# EAGLE schematic Hutschienenmoped_XL_12V (EAGLE 9.6.2)

## Sheet 1 of 12
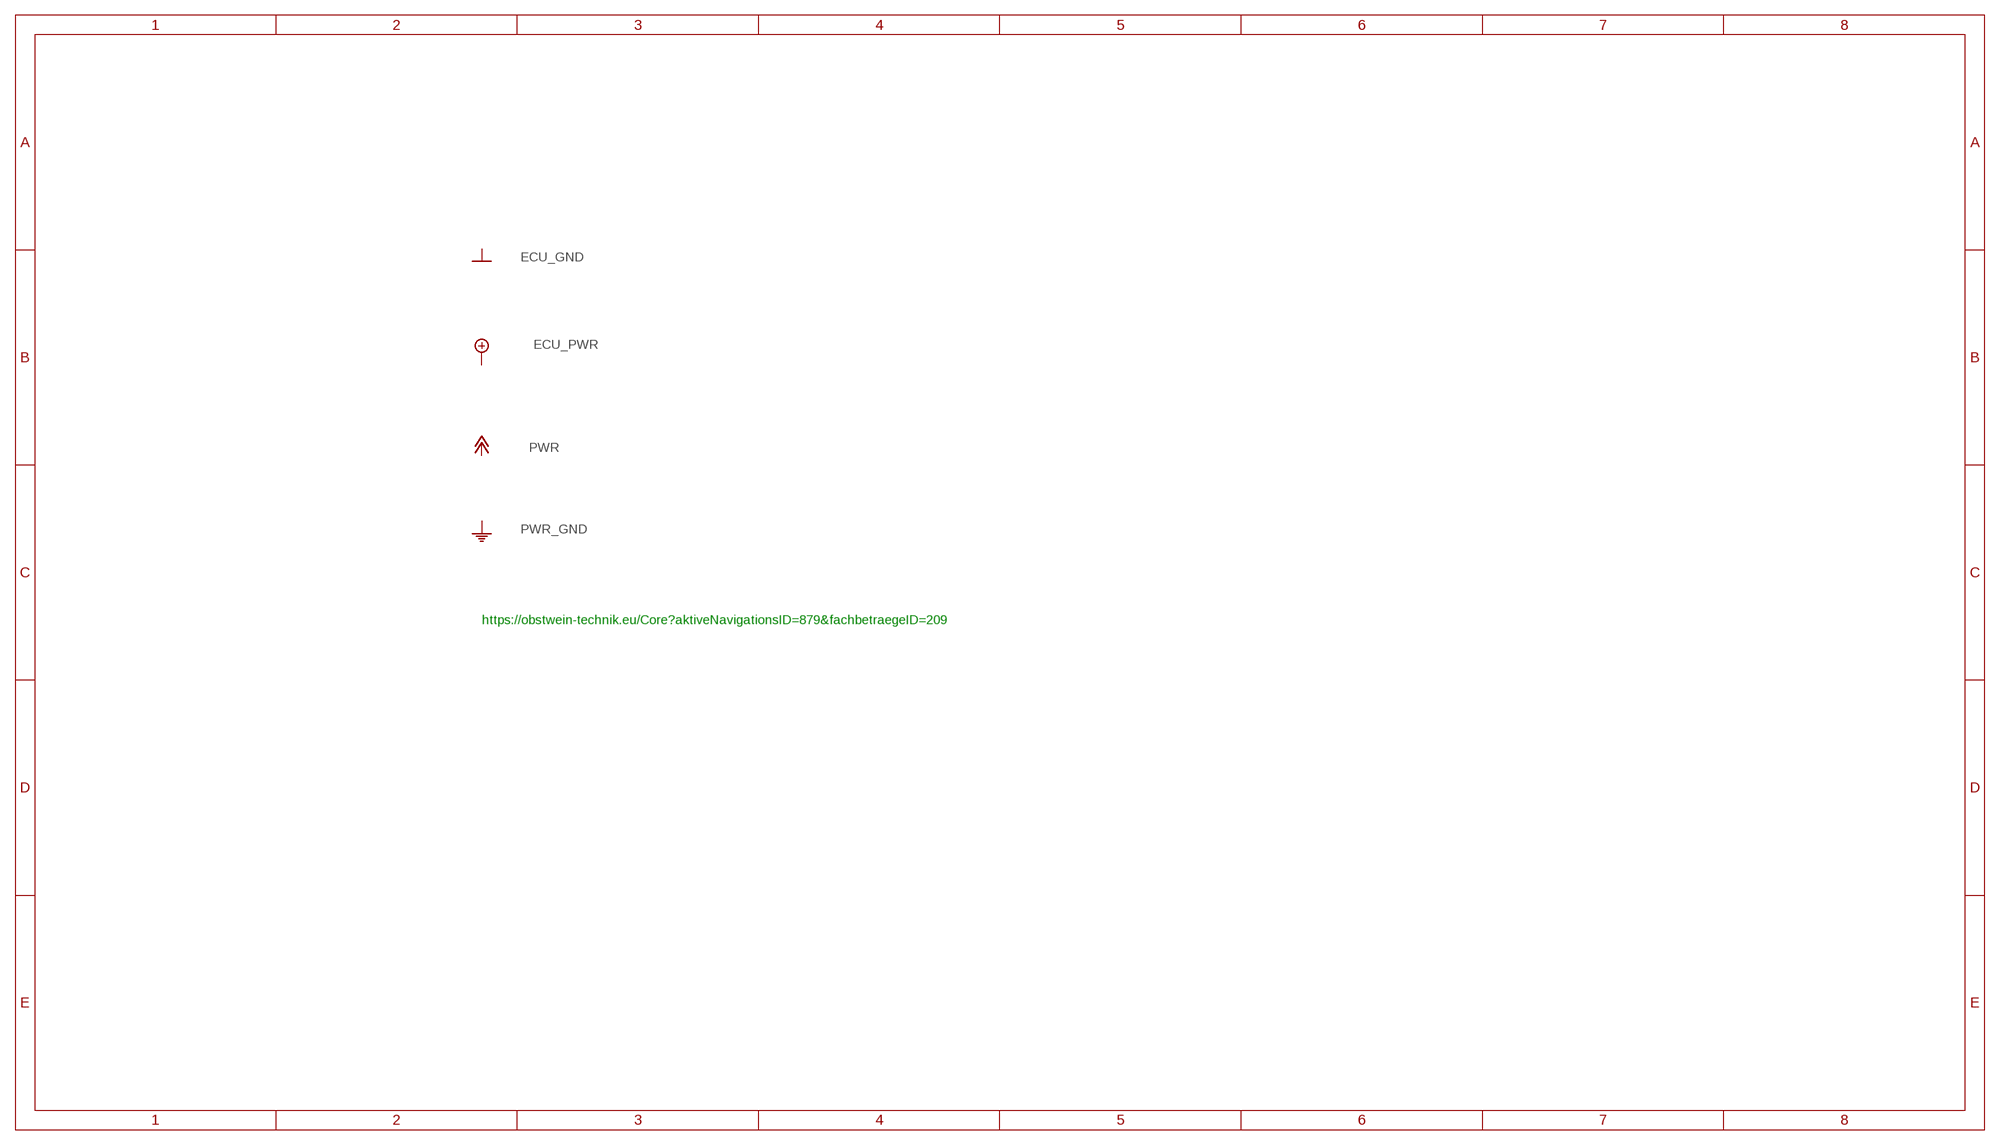
[diagram p0: schematic, sheet 1]

### Notes on the sheet
- https://obstwein-technik.eu/Core?aktiveNavigationsID=879&fachbetraegeID=209

## Sheet 2 of 12
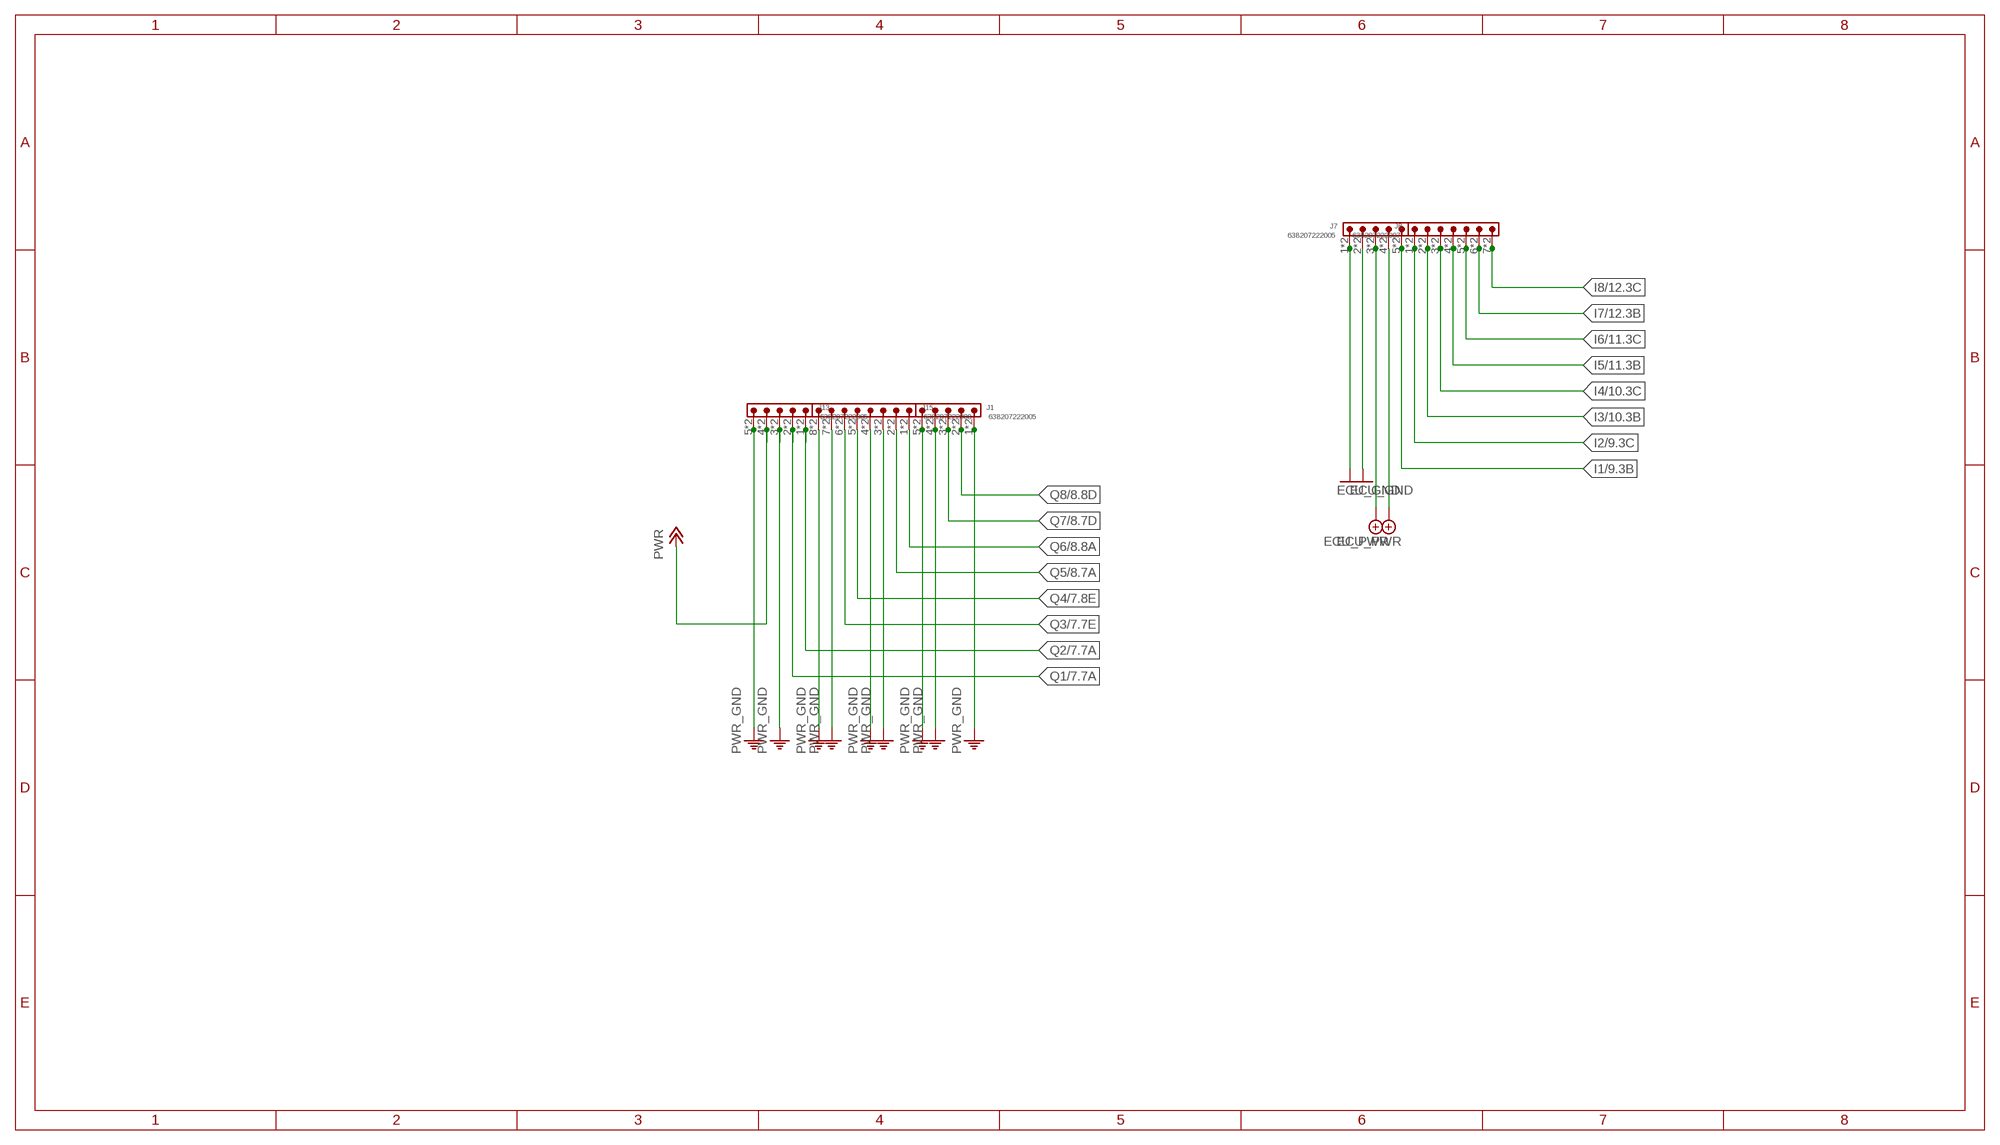
[diagram p1: schematic, sheet 2]

### Parts
J1  638207222005  638207222005  [638207222005]
J7  638207222005  638207222005  [638207222005]
J8  638207222007  638207222007  [638207222007]
J13  638207222005  638207222005  [638207222005]
J15  638207222008  638207222008  [638207222008]

### Nets
ECU_GND [GND]: J7.1 J7.2 J7.A1 J7.A2 ; also sheet 3,4,5,6,7,8,9,10,11,12
ECU_PWR: J7.3 J7.4 J7.A3 J7.A4 ; also sheet 3,7
I1: J7.5 J7.A5 ; also sheet 9
I2: J8.1 J8.A1 ; also sheet 9
I3: J8.2 J8.A2 ; also sheet 10
I4: J8.3 J8.A3 ; also sheet 10
I5: J8.4 J8.A4 ; also sheet 11
I6: J8.5 J8.A5 ; also sheet 11
I7: J8.6 J8.A6 ; also sheet 12
I8: J8.7 J8.A7 ; also sheet 12
PWR: J13.4 J13.A4 ; also sheet 7,8
PWR_GND: J1.1 J1.4 J1.5 J1.A1 J1.A4 J1.A5 J13.3 J13.5 J13.A3 J13.A5 J15.3 J15.4 J15.7 J15.8 J15.A3 J15.A4 J15.A7 J15.A8 ; also sheet 7,8
Q1: J13.2 J13.A2 ; also sheet 7
Q2: J13.1 J13.A1 ; also sheet 7
Q3: J15.6 J15.A6 ; also sheet 7
Q4: J15.5 J15.A5 ; also sheet 7
Q5: J15.2 J15.A2 ; also sheet 8
Q6: J15.1 J15.A1 ; also sheet 8
Q7: J1.3 J1.A3 ; also sheet 8
Q8: J1.2 J1.A2 ; also sheet 8

## Sheet 3 of 12
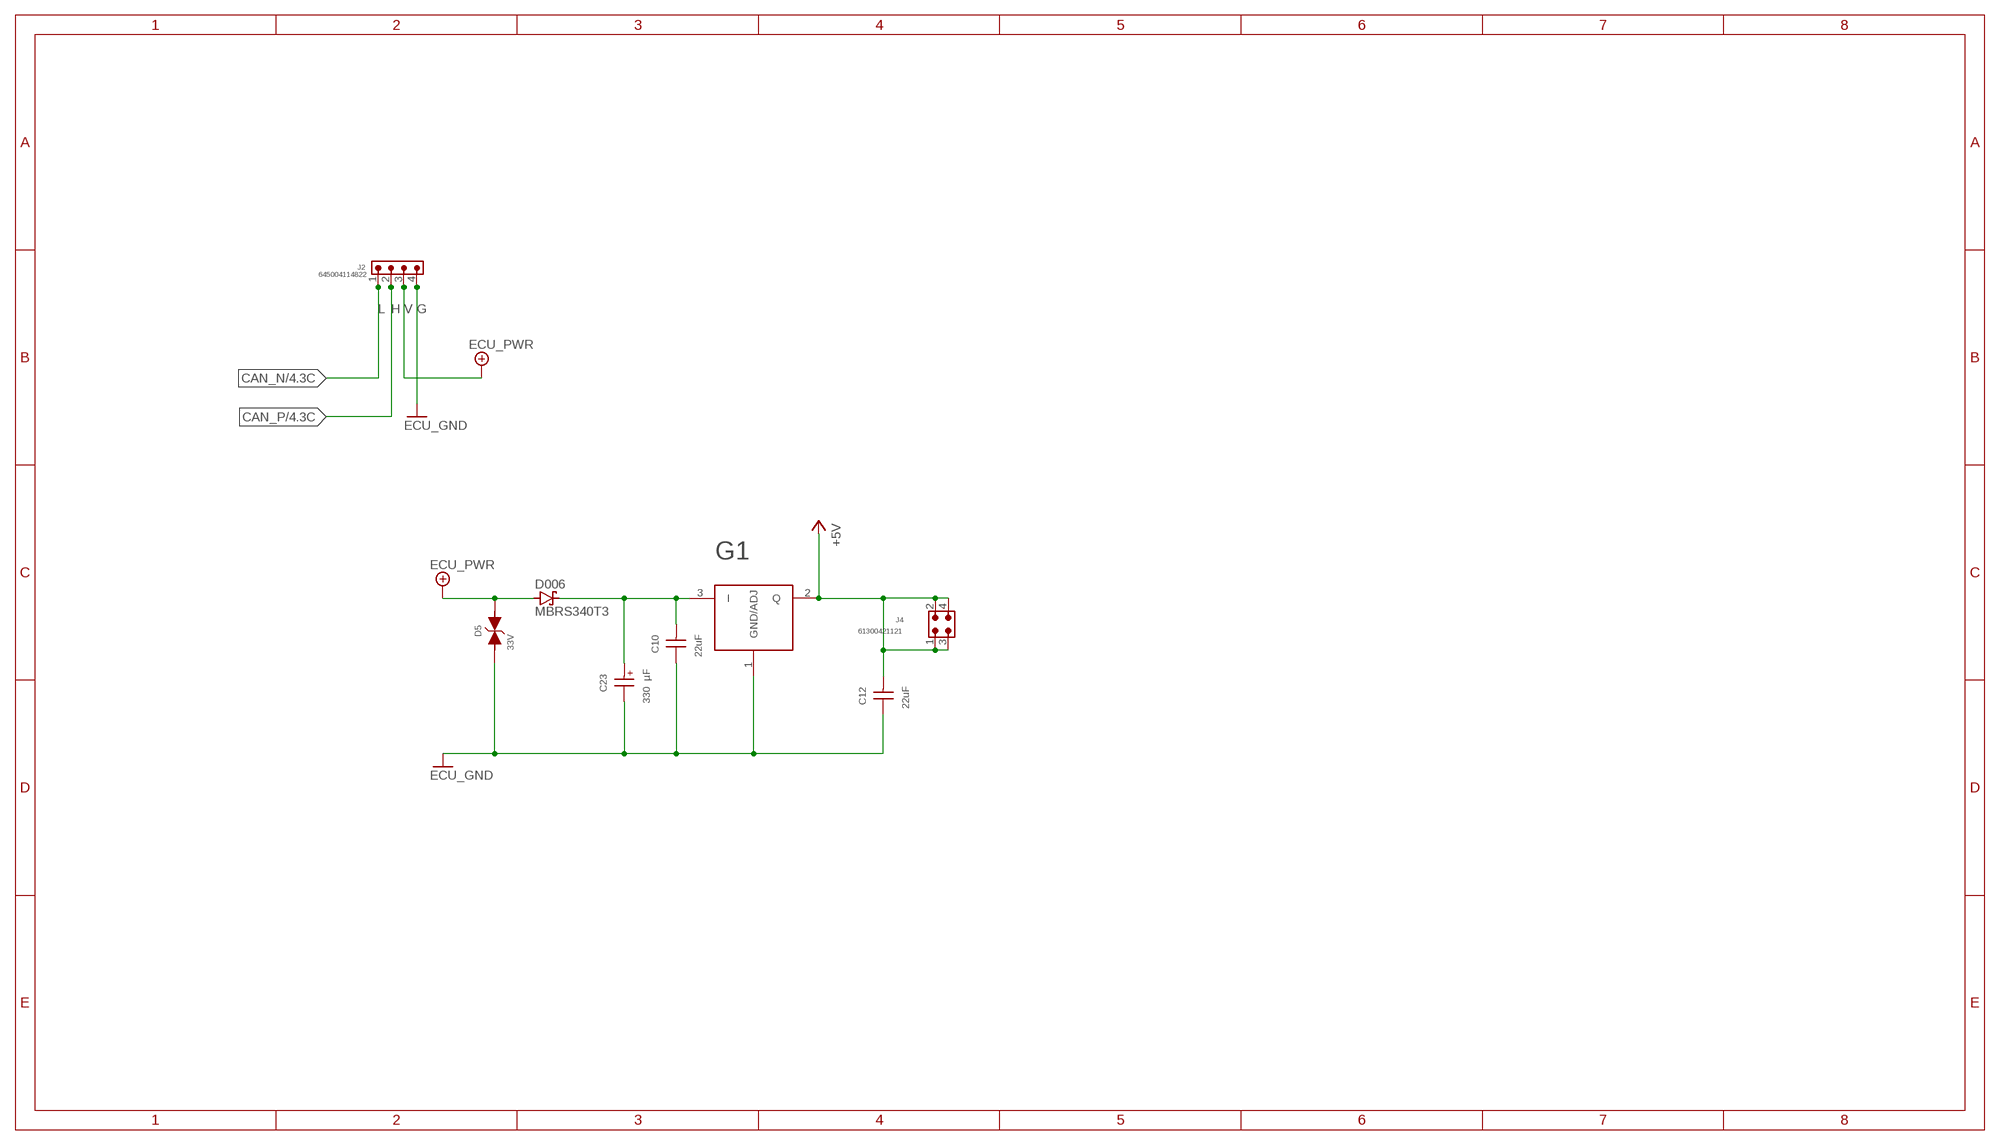
[diagram p2: schematic, sheet 3]

### Parts
C10  22uF  WCAP-CSGP_1210_H2.5_885012109014_25V(DC)  [WCAP-CSGP_1210_H2.5]
C12  22uF  WCAP-CSGP_0805_H1.25_885012107011_10V(DC)  [WCAP-CSGP_0805_H1.25_R]
C23  330 µF  WCAP-ASLI_12.5X14_865080662019  [WCAP-ASLI_12.5X14(DXL)]
D5  33V  WE-TVSP_DO-214AB_3000W_BI_824551331  [WE-TVSP_DO-214AB_BIDIRECTIONAL]
D006  MBRS340T3  [SMC]
G1  IFX27001TF_V50  [INF-PG-TO252-3-11_N]
J2  645004114822  [645004114822]
J4  61300421121  6130XX21121_61300421121  [61300421121]

### Nets
+5V: C12.2 G1.2(Q) J4.1 J4.2 J4.3 J4.4 ; also sheet 4,5,6
CAN_N: J2.1 ; also sheet 4
CAN_P: J2.2 ; also sheet 4
ECU_GND [GND]: C10.1 C12.1 C23.2(-) D5.1 G1.1(GND/ADJ) J2.4 ; also sheet 2,4,5,6,7,8,9,10,11,12
ECU_PWR: D5.2 D006.A J2.3 ; also sheet 2,7
N$3: C10.2 C23.1(+) D006.C G1.3(I)

### Notes on the sheet
- L | H | V | G

## Sheet 4 of 12
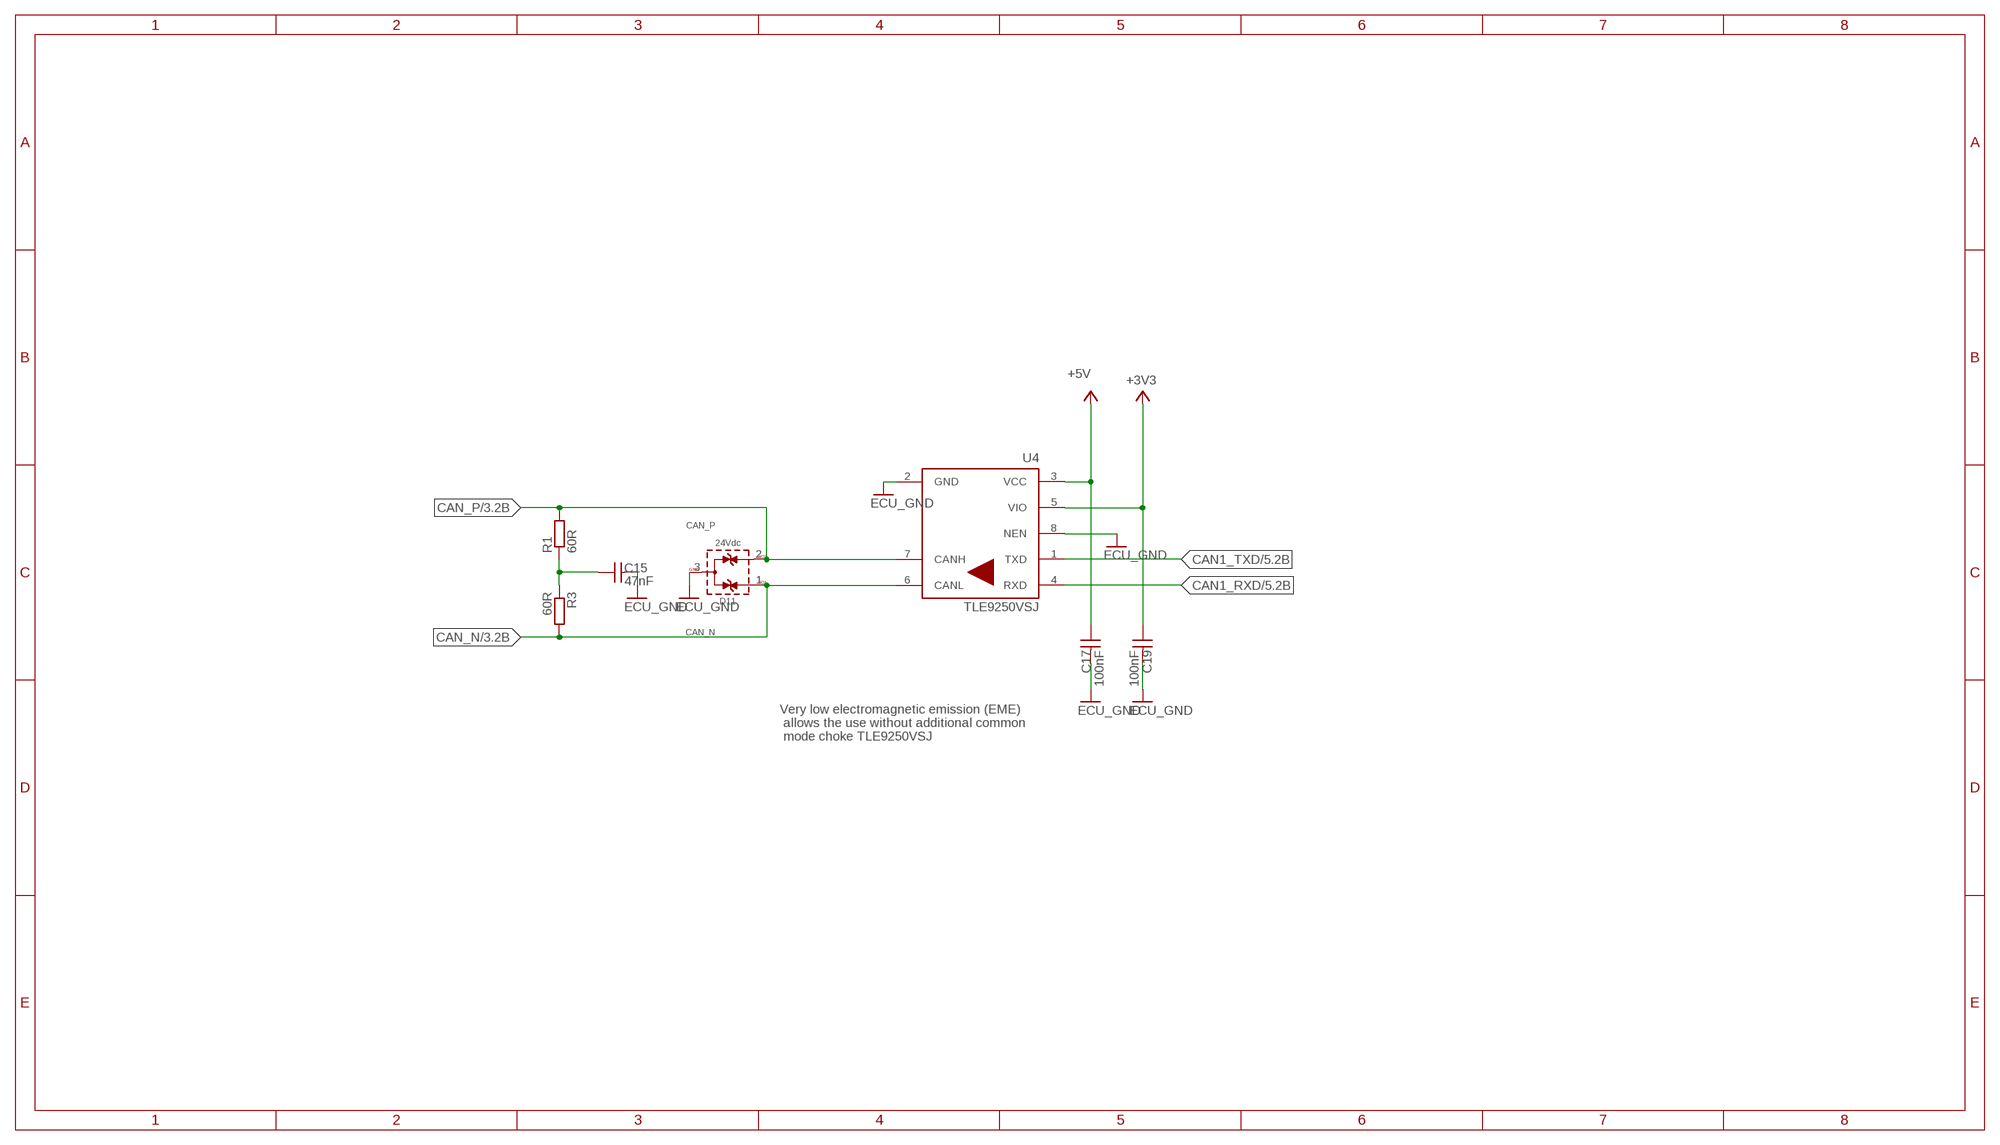
[diagram p3: schematic, sheet 4]

### Parts
C15  47nF  WCAP-CSGP_0805_H0.8_885012207096_50V(DC)_R  [WCAP-CSGP_0805_H0.8_R]
C17  100nF  WCAP-CSGP_0805_H0.8_885012207098_50V(DC)_R  [WCAP-CSGP_0805_H0.8_R]
C19  100nF  WCAP-CSGP_0805_H0.8_885012207098_50V(DC)_R  [WCAP-CSGP_0805_H0.8_R]
D11  24Vdc  WE-TVS_SOT23-3L_824094024  [WE-TVS_SOT23-3L]
R1  60R  R-EU_R0805  [R0805]
R3  60R  R-EU_R0805  [R0805]
U4  TLE9250VSJ  [SOIC127P602X173-8N-V]

### Nets
+3V3: C19.1 U4.5(VIO) ; also sheet 5,6,9,10,11,12
+5V: C17.1 U4.3(VCC) ; also sheet 3,5,6
CAN1_RXD: U4.4(RXD) ; also sheet 5,6
CAN1_TXD: U4.1(TXD) ; also sheet 5,6
CAN_N: D11.1(I/O1) R3.2 U4.6(CANL) ; also sheet 3
CAN_P: D11.2(I/O2) R1.2 U4.7(CANH) ; also sheet 3
ECU_GND [GND]: C15.2 C17.2 C19.2 D11.3(GND) U4.2(GND) U4.8(NEN) ; also sheet 2,3,5,6,7,8,9,10,11,12
N$17: C15.1 R1.1 R3.1

### Notes on the sheet
- Very low electromagnetic emission (EME)
   allows the use without additional common
   mode choke TLE9250VSJ

## Sheet 5 of 12
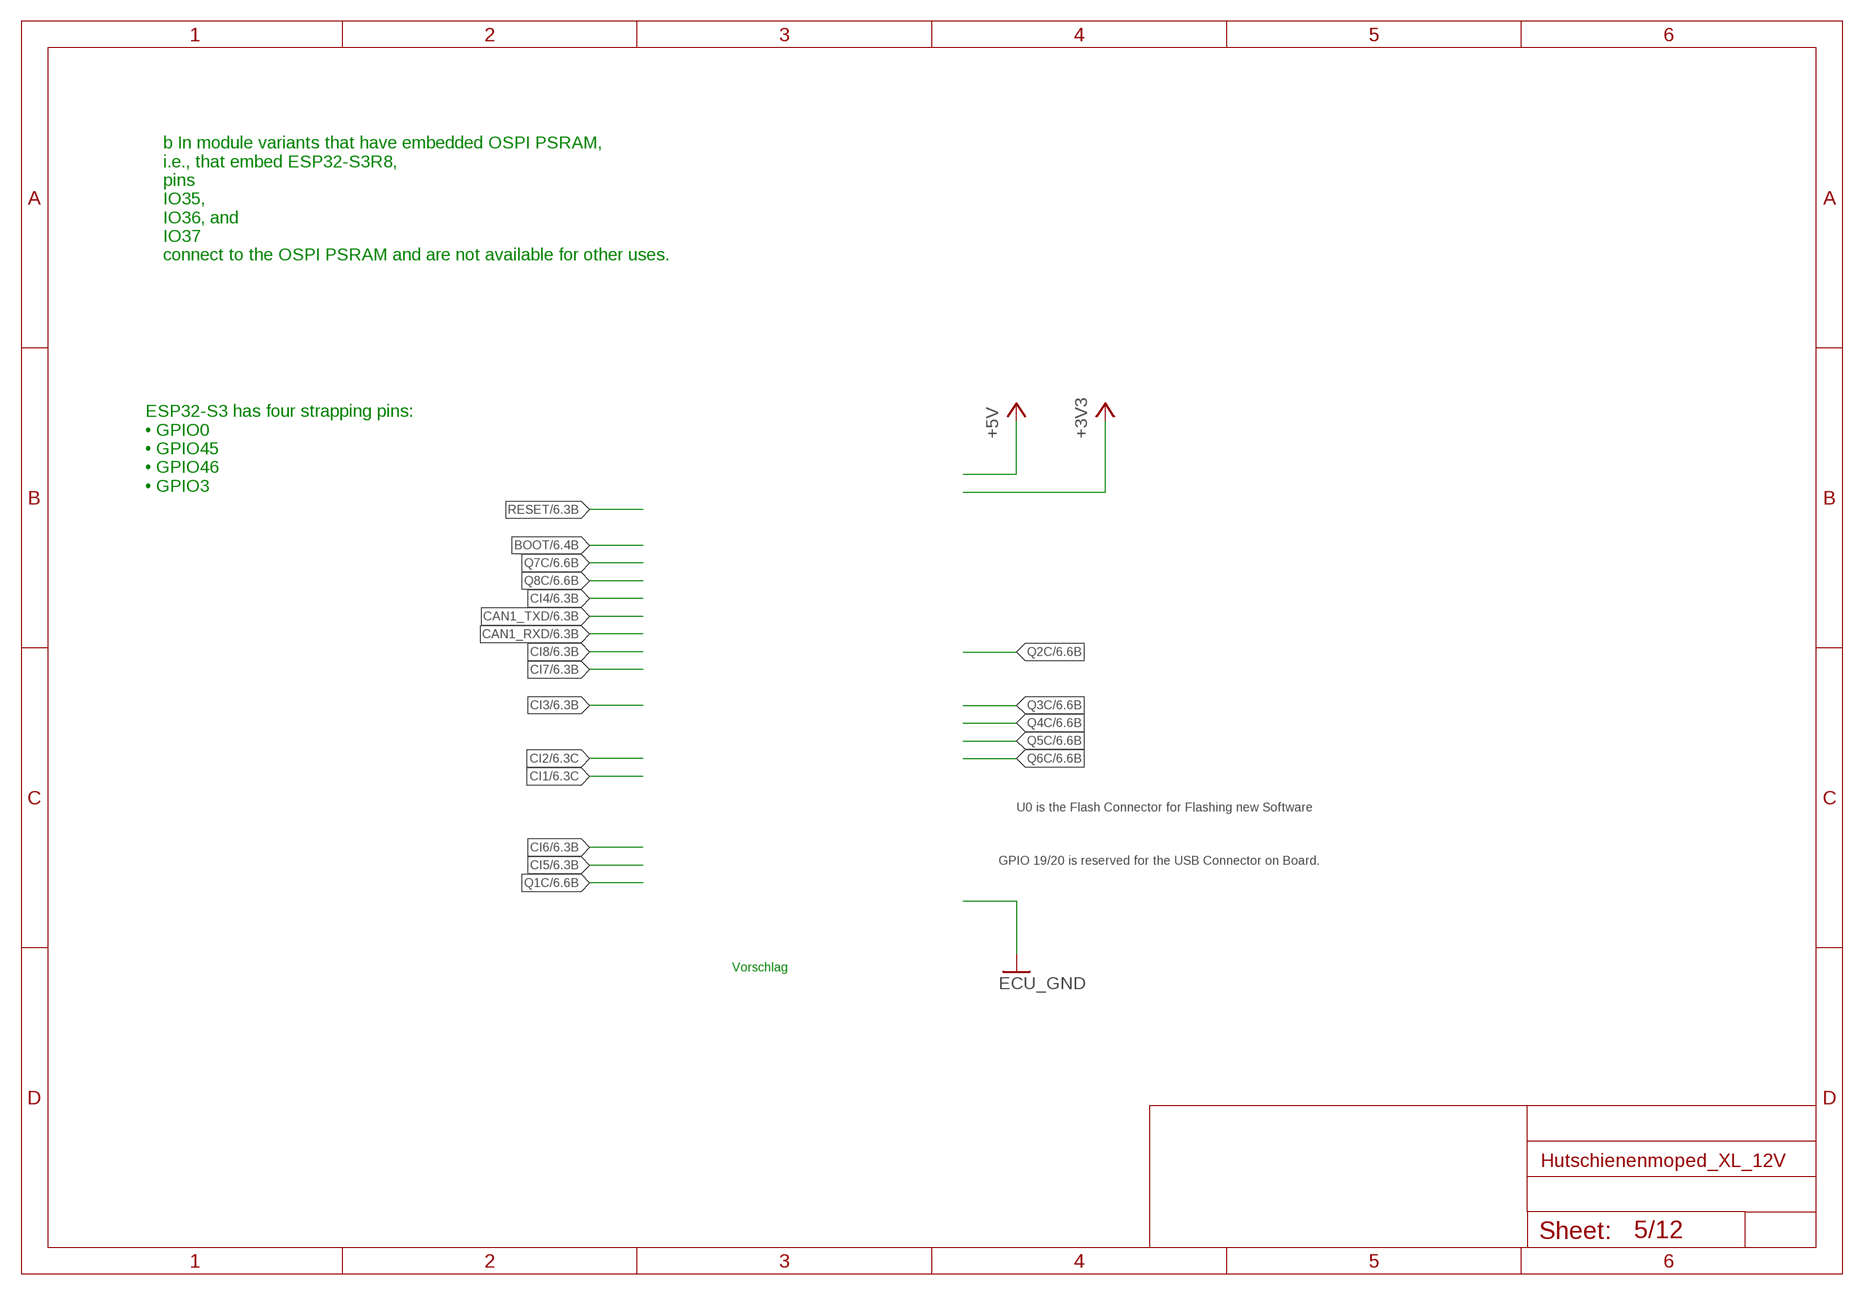
[diagram p4: schematic, sheet 5]

### Notes on the sheet
- b In module variants that have embedded OSPI PSRAM, 
  i.e., that embed ESP32-S3R8, 
  pins 
  IO35, 
  IO36, and 
  IO37 
  connect to the OSPI PSRAM and are not available for other uses.
- ESP32-S3 has four strapping pins: 
  • GPIO0 
  • GPIO45 
  • GPIO46 
  • GPIO3
- U0 is the Flash Connector for Flashing new Software
- GPIO 19/20 is reserved for the USB Connector on Board.
- Vorschlag

## Sheet 6 of 12
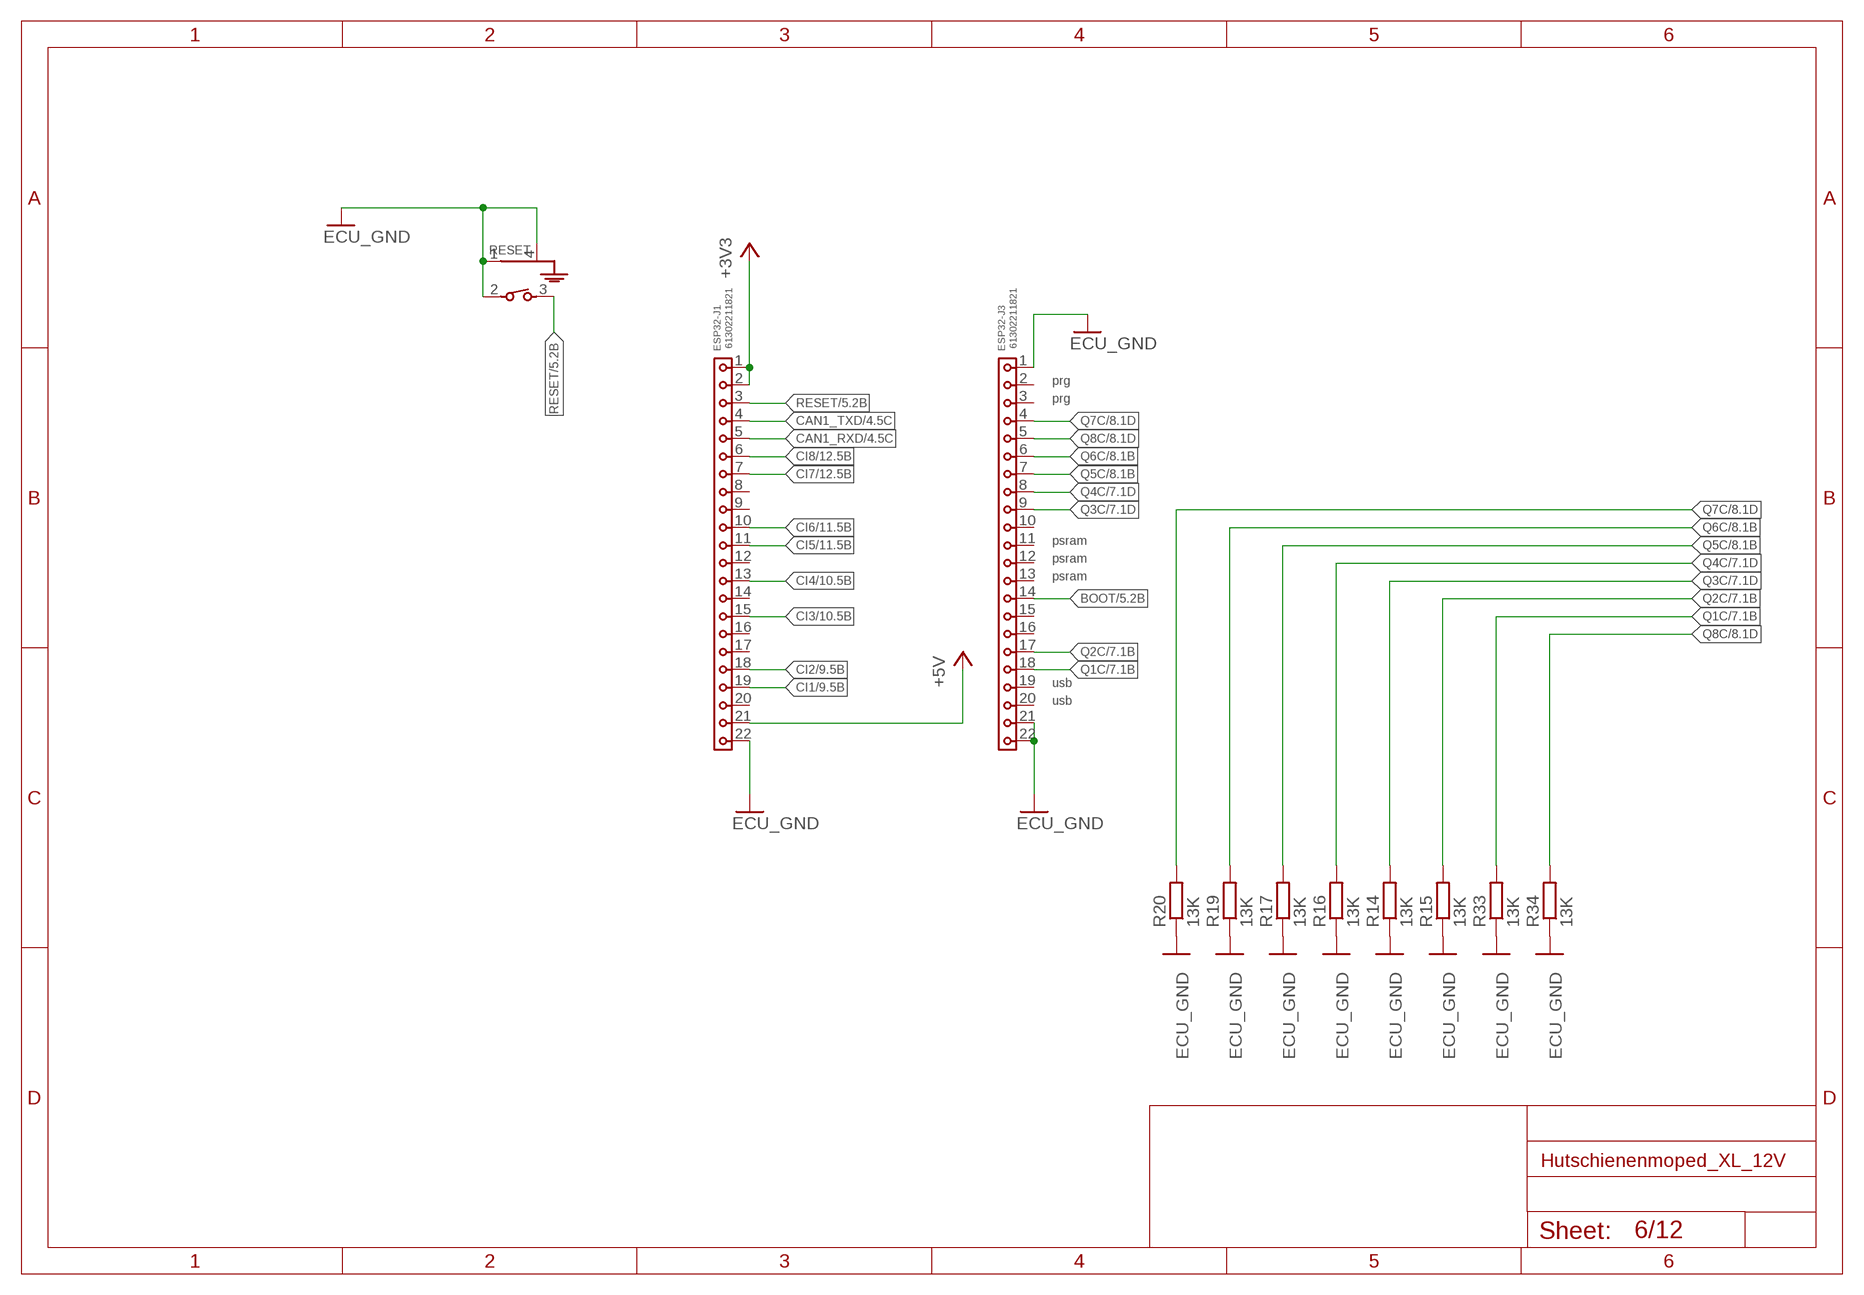
[diagram p5: schematic, sheet 6]

### Parts
ESP32-J1  61302211821  6130XX11821_61302211821  [61302211821]
ESP32-J3  61302211821  6130XX11821_61302211821  [61302211821]
R14  13K  R-EU_R1206  [R1206]
R15  13K  R-EU_R1206  [R1206]
R16  13K  R-EU_R1206  [R1206]
R17  13K  R-EU_R1206  [R1206]
R19  13K  R-EU_R1206  [R1206]
R20  13K  R-EU_R1206  [R1206]
R33  13K  R-EU_R1206  [R1206]
R34  13K  R-EU_R1206  [R1206]
RESET  431256083736  [4312560837X6]

### Nets
+3V3: ESP32-J1.1 ESP32-J1.2 ; also sheet 4,5,9,10,11,12
+5V: ESP32-J1.21 ; also sheet 3,4,5
BOOT: ESP32-J3.14 ; also sheet 5
CAN1_RXD: ESP32-J1.5 ; also sheet 4,5
CAN1_TXD: ESP32-J1.4 ; also sheet 4,5
CI1: ESP32-J1.19 ; also sheet 5,9
CI2: ESP32-J1.18 ; also sheet 5,9
CI3: ESP32-J1.15 ; also sheet 5,10
CI4: ESP32-J1.13 ; also sheet 5,10
CI5: ESP32-J1.11 ; also sheet 5,11
CI6: ESP32-J1.10 ; also sheet 5,11
CI7: ESP32-J1.7 ; also sheet 5,12
CI8: ESP32-J1.6 ; also sheet 5,12
ECU_GND [GND]: ESP32-J1.22 ESP32-J3.1 ESP32-J3.21 ESP32-J3.22 R14.1 R15.1 R16.1 R17.1 R19.1 R20.1 R33.1 R34.1 RESET.1(GND1) RESET.2 RESET.4(GND) ; also sheet 2,3,4,5,7,8,9,10,11,12
Q1C: ESP32-J3.18 R33.2 ; also sheet 5,7
Q2C: ESP32-J3.17 R15.2 ; also sheet 5,7
Q3C: ESP32-J3.9 R14.2 ; also sheet 5,7
Q4C: ESP32-J3.8 R16.2 ; also sheet 5,7
Q5C: ESP32-J3.7 R17.2 ; also sheet 5,8
Q6C: ESP32-J3.6 R19.2 ; also sheet 5,8
Q7C: ESP32-J3.4 R20.2 ; also sheet 5,8
Q8C: ESP32-J3.5 R34.2 ; also sheet 5,8
RESET: ESP32-J1.3 RESET.3 ; also sheet 5
Unconnected: ESP32-J1.8 ESP32-J1.9 ESP32-J1.12 ESP32-J1.14 ESP32-J1.16 ESP32-J1.17 ESP32-J1.20 ESP32-J3.2 ESP32-J3.3 ESP32-J3.10 ESP32-J3.11 ESP32-J3.12 ESP32-J3.13 ESP32-J3.15 ESP32-J3.16 ESP32-J3.19 ESP32-J3.20

### Notes on the sheet
- prg
- prg
- psram
- psram
- psram
- usb
- usb

## Sheet 7 of 12
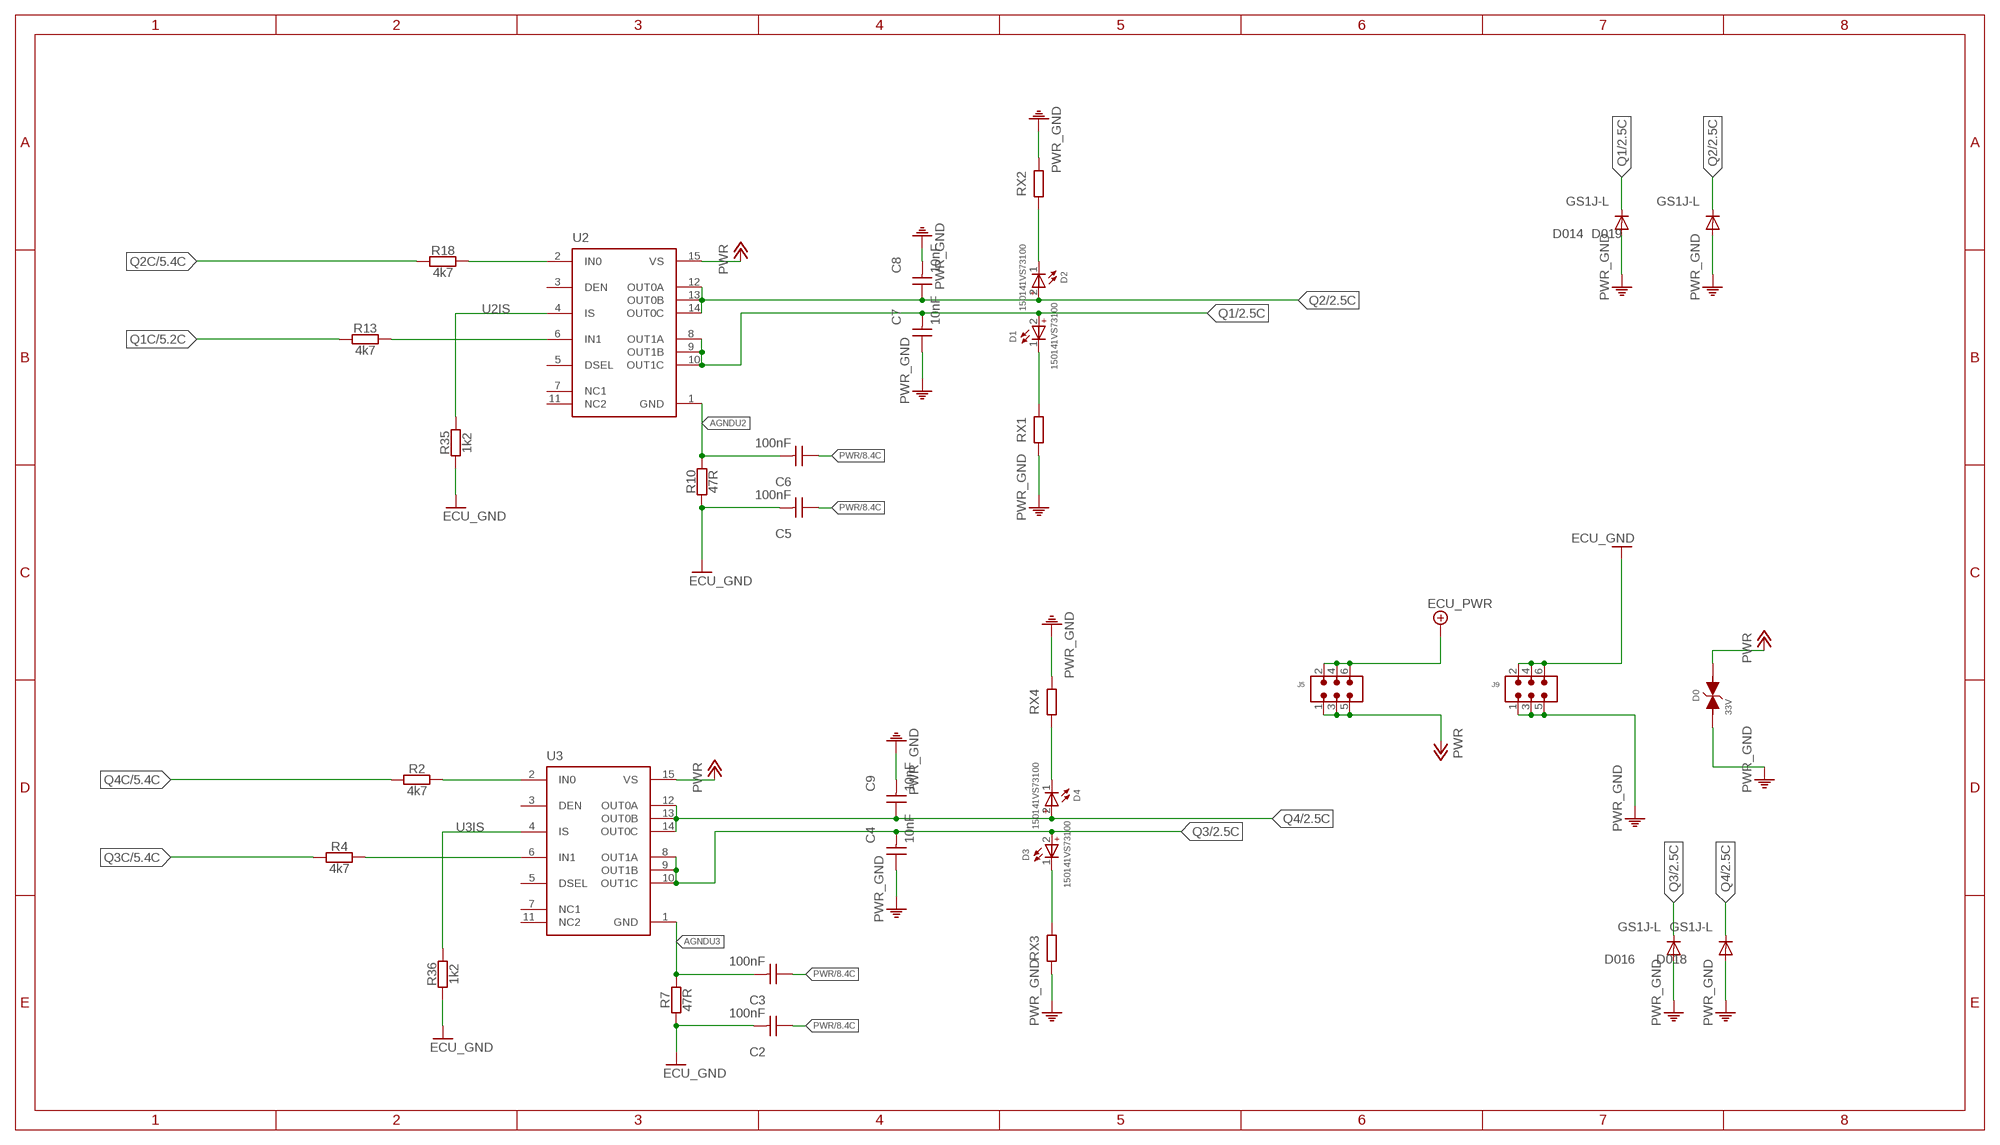
[diagram p6: schematic, sheet 7]

### Parts
C2  100nF  WCAP-CSGP_0805_H0.8_885012207098_50V(DC)_R  [WCAP-CSGP_0805_H0.8_R]
C3  100nF  WCAP-CSGP_0805_H0.8_885012207098_50V(DC)_R  [WCAP-CSGP_0805_H0.8_R]
C4  10nF  WCAP-CSGP_0805_H0.8_885012207092_50V(DC)_R  [WCAP-CSGP_0805_H0.8_R]
C5  100nF  WCAP-CSGP_0805_H0.8_885012207098_50V(DC)_R  [WCAP-CSGP_0805_H0.8_R]
C6  100nF  WCAP-CSGP_0805_H0.8_885012207098_50V(DC)_R  [WCAP-CSGP_0805_H0.8_R]
C7  10nF  WCAP-CSGP_0805_H0.8_885012207092_50V(DC)_R  [WCAP-CSGP_0805_H0.8_R]
C8  10nF  WCAP-CSGP_0805_H0.8_885012207092_50V(DC)_R  [WCAP-CSGP_0805_H0.8_R]
C9  10nF  WCAP-CSGP_0805_H0.8_885012207092_50V(DC)_R  [WCAP-CSGP_0805_H0.8_R]
D0  33V  WE-TVSP_DO-214AB_3000W_BI_824551331  [WE-TVSP_DO-214AB_BIDIRECTIONAL]
D1  150141VS73100  WL-SMTW_3528_150141VS73100  [WL-SMTW_3528]
D2  150141VS73100  WL-SMTW_3528_150141VS73100  [WL-SMTW_3528]
D3  150141VS73100  WL-SMTW_3528_150141VS73100  [WL-SMTW_3528]
D4  150141VS73100  WL-SMTW_3528_150141VS73100  [WL-SMTW_3528]
D014  GS1J-L  [SMA_DO-214AC]
D016  GS1J-L  [SMA_DO-214AC]
D018  GS1J-L  [SMA_DO-214AC]
D019  GS1J-L  [SMA_DO-214AC]
J5  6130XX21121_61300621121  [61300621121]
J9  6130XX21121_61300621121  [61300621121]
R2  4k7  R-EU_R0805  [R0805]
R4  4k7  R-EU_R0805  [R0805]
R7  47R  R-EU_R0805  [R0805]
R10  47R  R-EU_R0805  [R0805]
R13  4k7  R-EU_R0805  [R0805]
R18  4k7  R-EU_R0805  [R0805]
R35  1k2  R-EU_R0805  [R0805]
R36  1k2  R-EU_R0805  [R0805]
RX1  470Ohm  R-EU_R1206  [R1206]
RX2  470Ohm  R-EU_R1206  [R1206]
RX3  470Ohm  R-EU_R1206  [R1206]
RX4  470Ohm  R-EU_R1206  [R1206]
U2  BTS7030-2EPA  [SOP65P600X115-15N-V]
U3  BTS7030-2EPA  [SOP65P600X115-15N-V]

### Nets
AGNDU2: C6.2 R10.2 U2.1(GND)
AGNDU3: C3.2 R7.2 U3.1(GND)
ECU_GND [GND]: C2.2 C5.2 J9.2 J9.4 J9.6 R7.1 R10.1 R35.1 R36.1 ; also sheet 2,3,4,5,6,8,9,10,11,12
ECU_PWR: J5.2 J5.4 J5.6 ; also sheet 2,3
N$1 [GND]: D4.1(-) RX4.1
N$2: R2.2 U3.2(IN0)
N$4: R4.2 U3.6(IN1)
N$6 [GND]: D2.1(-) RX2.1
N$8 [GND]: D1.1(-) RX1.2
N$9 [GND]: D3.1(-) RX3.2
N$10: R18.2 U2.2(IN0)
N$14: R13.2 U2.6(IN1)
PWR: C2.1 C3.1 C5.1 C6.1 D0.2 J5.1 J5.3 J5.5 U2.15(VS) U3.15(VS) ; also sheet 2,8
PWR_GND: C4.1 C7.1 C8.2 C9.2 D0.1 D014.A D016.A D018.A D019.A J9.1 J9.3 J9.5 RX1.1 RX2.2 RX3.1 RX4.2 ; also sheet 2,8
Q1: C7.2 D1.2(+) D014.C U2.8(OUT1A) U2.9(OUT1B) U2.10(OUT1C) ; also sheet 2
Q1C: R13.1 ; also sheet 5,6
Q2: C8.1 D2.2(+) D019.C U2.12(OUT0A) U2.13(OUT0B) U2.14(OUT0C) ; also sheet 2
Q2C: R18.1 ; also sheet 5,6
Q3: C4.2 D3.2(+) D016.C U3.8(OUT1A) U3.9(OUT1B) U3.10(OUT1C) ; also sheet 2
Q3C: R4.1 ; also sheet 5,6
Q4: C9.1 D4.2(+) D018.C U3.12(OUT0A) U3.13(OUT0B) U3.14(OUT0C) ; also sheet 2
Q4C: R2.1 ; also sheet 5,6
U2IS: R35.2 U2.4(IS)
U3IS: R36.2 U3.4(IS)
Unconnected: U2.3(DEN) U2.5(DSEL) U2.7(NC1) U2.11(NC2) U3.3(DEN) U3.5(DSEL) U3.7(NC1) U3.11(NC2)

## Sheet 8 of 12
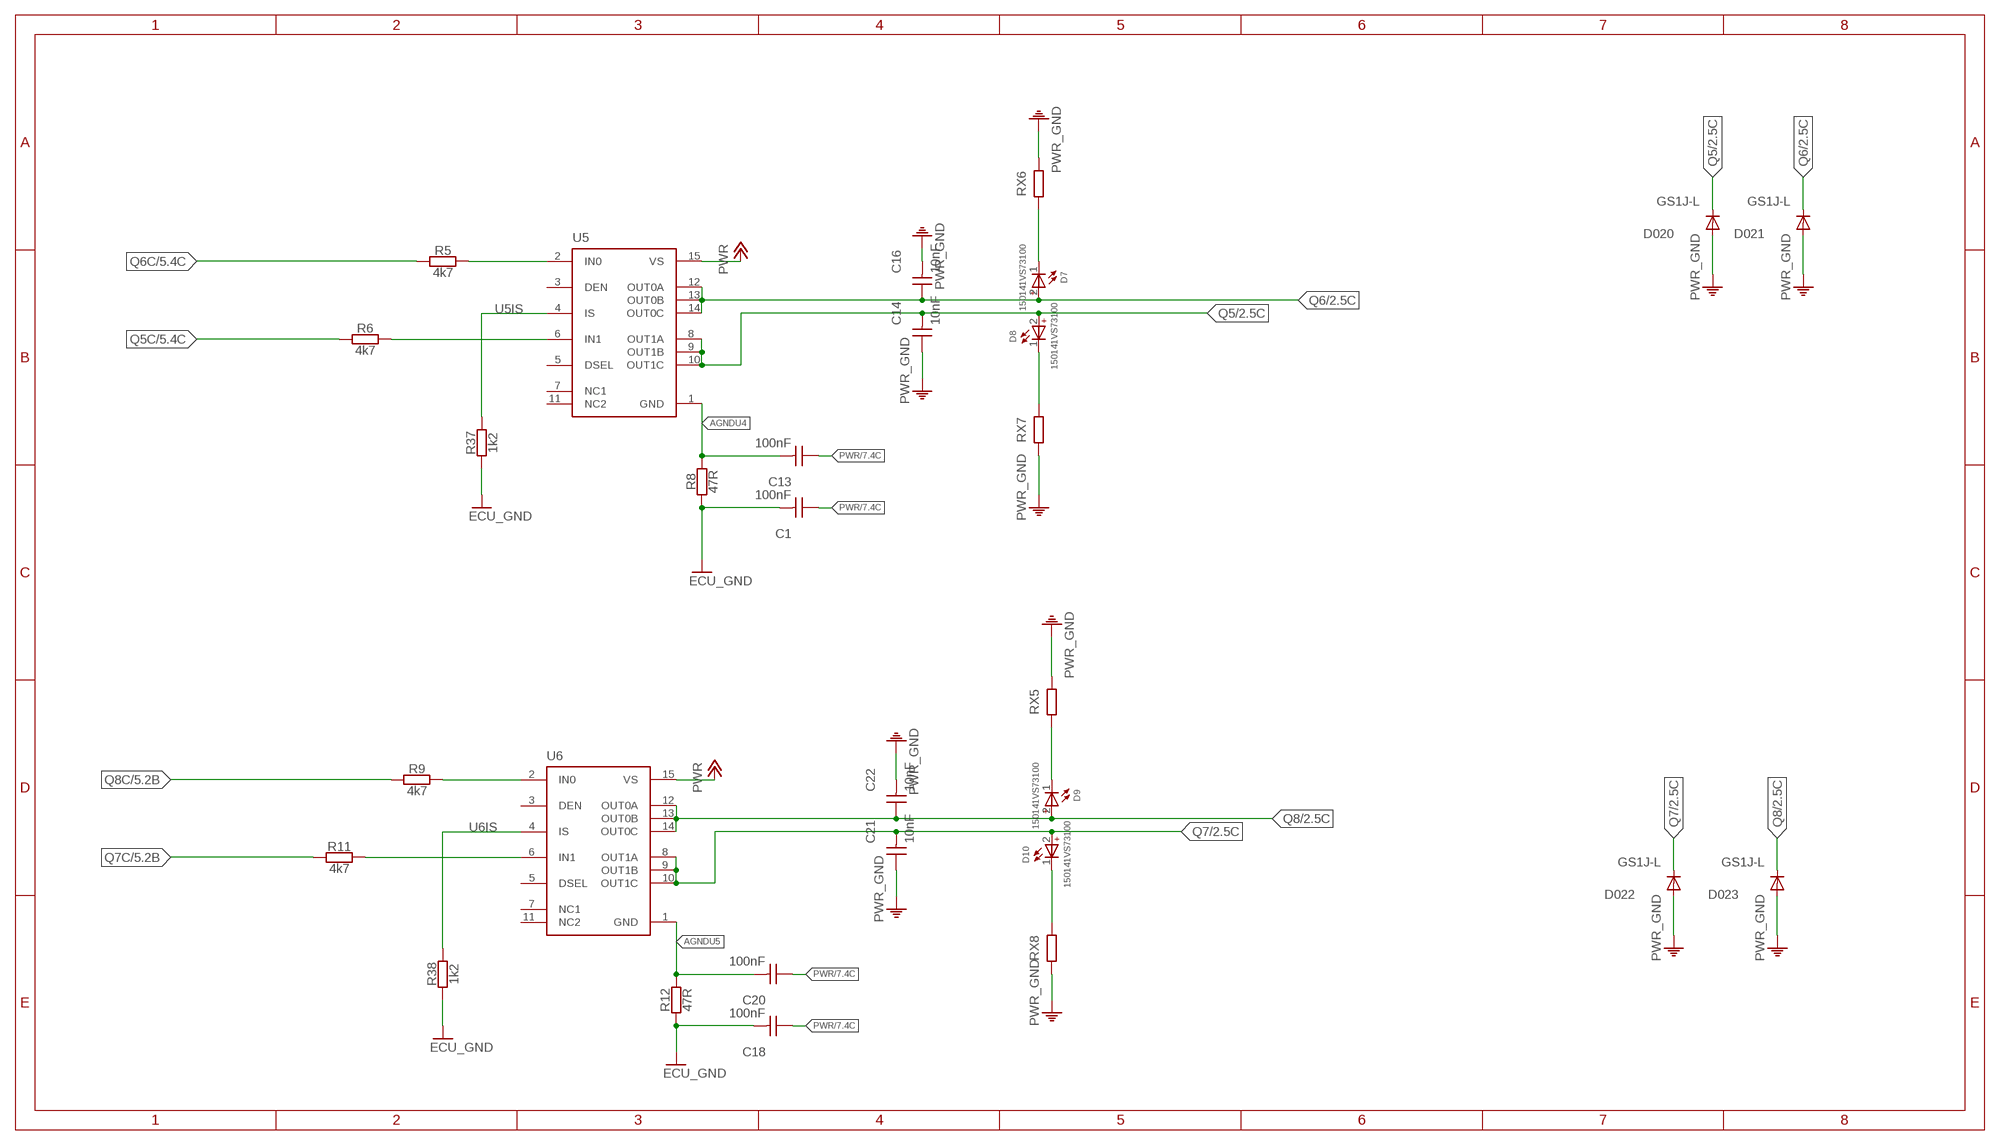
[diagram p7: schematic, sheet 8]

### Parts
C1  100nF  WCAP-CSGP_0805_H0.8_885012207098_50V(DC)_R  [WCAP-CSGP_0805_H0.8_R]
C13  100nF  WCAP-CSGP_0805_H0.8_885012207098_50V(DC)_R  [WCAP-CSGP_0805_H0.8_R]
C14  10nF  WCAP-CSGP_0805_H0.8_885012207092_50V(DC)_R  [WCAP-CSGP_0805_H0.8_R]
C16  10nF  WCAP-CSGP_0805_H0.8_885012207092_50V(DC)_R  [WCAP-CSGP_0805_H0.8_R]
C18  100nF  WCAP-CSGP_0805_H0.8_885012207098_50V(DC)_R  [WCAP-CSGP_0805_H0.8_R]
C20  100nF  WCAP-CSGP_0805_H0.8_885012207098_50V(DC)_R  [WCAP-CSGP_0805_H0.8_R]
C21  10nF  WCAP-CSGP_0805_H0.8_885012207092_50V(DC)_R  [WCAP-CSGP_0805_H0.8_R]
C22  10nF  WCAP-CSGP_0805_H0.8_885012207092_50V(DC)_R  [WCAP-CSGP_0805_H0.8_R]
D7  150141VS73100  WL-SMTW_3528_150141VS73100  [WL-SMTW_3528]
D8  150141VS73100  WL-SMTW_3528_150141VS73100  [WL-SMTW_3528]
D9  150141VS73100  WL-SMTW_3528_150141VS73100  [WL-SMTW_3528]
D10  150141VS73100  WL-SMTW_3528_150141VS73100  [WL-SMTW_3528]
D020  GS1J-L  [SMA_DO-214AC]
D021  GS1J-L  [SMA_DO-214AC]
D022  GS1J-L  [SMA_DO-214AC]
D023  GS1J-L  [SMA_DO-214AC]
R5  4k7  R-EU_R0805  [R0805]
R6  4k7  R-EU_R0805  [R0805]
R8  47R  R-EU_R0805  [R0805]
R9  4k7  R-EU_R0805  [R0805]
R11  4k7  R-EU_R0805  [R0805]
R12  47R  R-EU_R0805  [R0805]
R37  1k2  R-EU_R0805  [R0805]
R38  1k2  R-EU_R0805  [R0805]
RX5  470Ohm  R-EU_R1206  [R1206]
RX6  470Ohm  R-EU_R1206  [R1206]
RX7  470Ohm  R-EU_R1206  [R1206]
RX8  470Ohm  R-EU_R1206  [R1206]
U5  BTS7030-2EPA  [SOP65P600X115-15N-V]
U6  BTS7030-2EPA  [SOP65P600X115-15N-V]

### Nets
+6V [GND]: D7.1(-) RX6.1
AGNDU4: C13.2 R8.2 U5.1(GND)
AGNDU5: C20.2 R12.2 U6.1(GND)
ECU_GND [GND]: C1.2 C18.2 R8.1 R12.1 R37.1 R38.1 ; also sheet 2,3,4,5,6,7,9,10,11,12
N$5: R5.2 U5.2(IN0)
N$11: R6.2 U5.6(IN1)
N$12: R9.2 U6.2(IN0)
N$13: R11.2 U6.6(IN1)
N$15 [GND]: D9.1(-) RX5.1
N$18 [GND]: D8.1(-) RX7.2
N$19 [GND]: D10.1(-) RX8.2
PWR: C1.1 C13.1 C18.1 C20.1 U5.15(VS) U6.15(VS) ; also sheet 2,7
PWR_GND: C14.1 C16.2 C21.1 C22.2 D020.A D021.A D022.A D023.A RX5.2 RX6.2 RX7.1 RX8.1 ; also sheet 2,7
Q5: C14.2 D8.2(+) D020.C U5.8(OUT1A) U5.9(OUT1B) U5.10(OUT1C) ; also sheet 2
Q5C: R6.1 ; also sheet 5,6
Q6: C16.1 D7.2(+) D021.C U5.12(OUT0A) U5.13(OUT0B) U5.14(OUT0C) ; also sheet 2
Q6C: R5.1 ; also sheet 5,6
Q7: C21.2 D10.2(+) D022.C U6.8(OUT1A) U6.9(OUT1B) U6.10(OUT1C) ; also sheet 2
Q7C: R11.1 ; also sheet 5,6
Q8: C22.1 D9.2(+) D023.C U6.12(OUT0A) U6.13(OUT0B) U6.14(OUT0C) ; also sheet 2
Q8C: R9.1 ; also sheet 5,6
U5IS: R37.2 U5.4(IS)
U6IS: R38.2 U6.4(IS)
Unconnected: U5.3(DEN) U5.5(DSEL) U5.7(NC1) U5.11(NC2) U6.3(DEN) U6.5(DSEL) U6.7(NC1) U6.11(NC2)

## Sheet 9 of 12
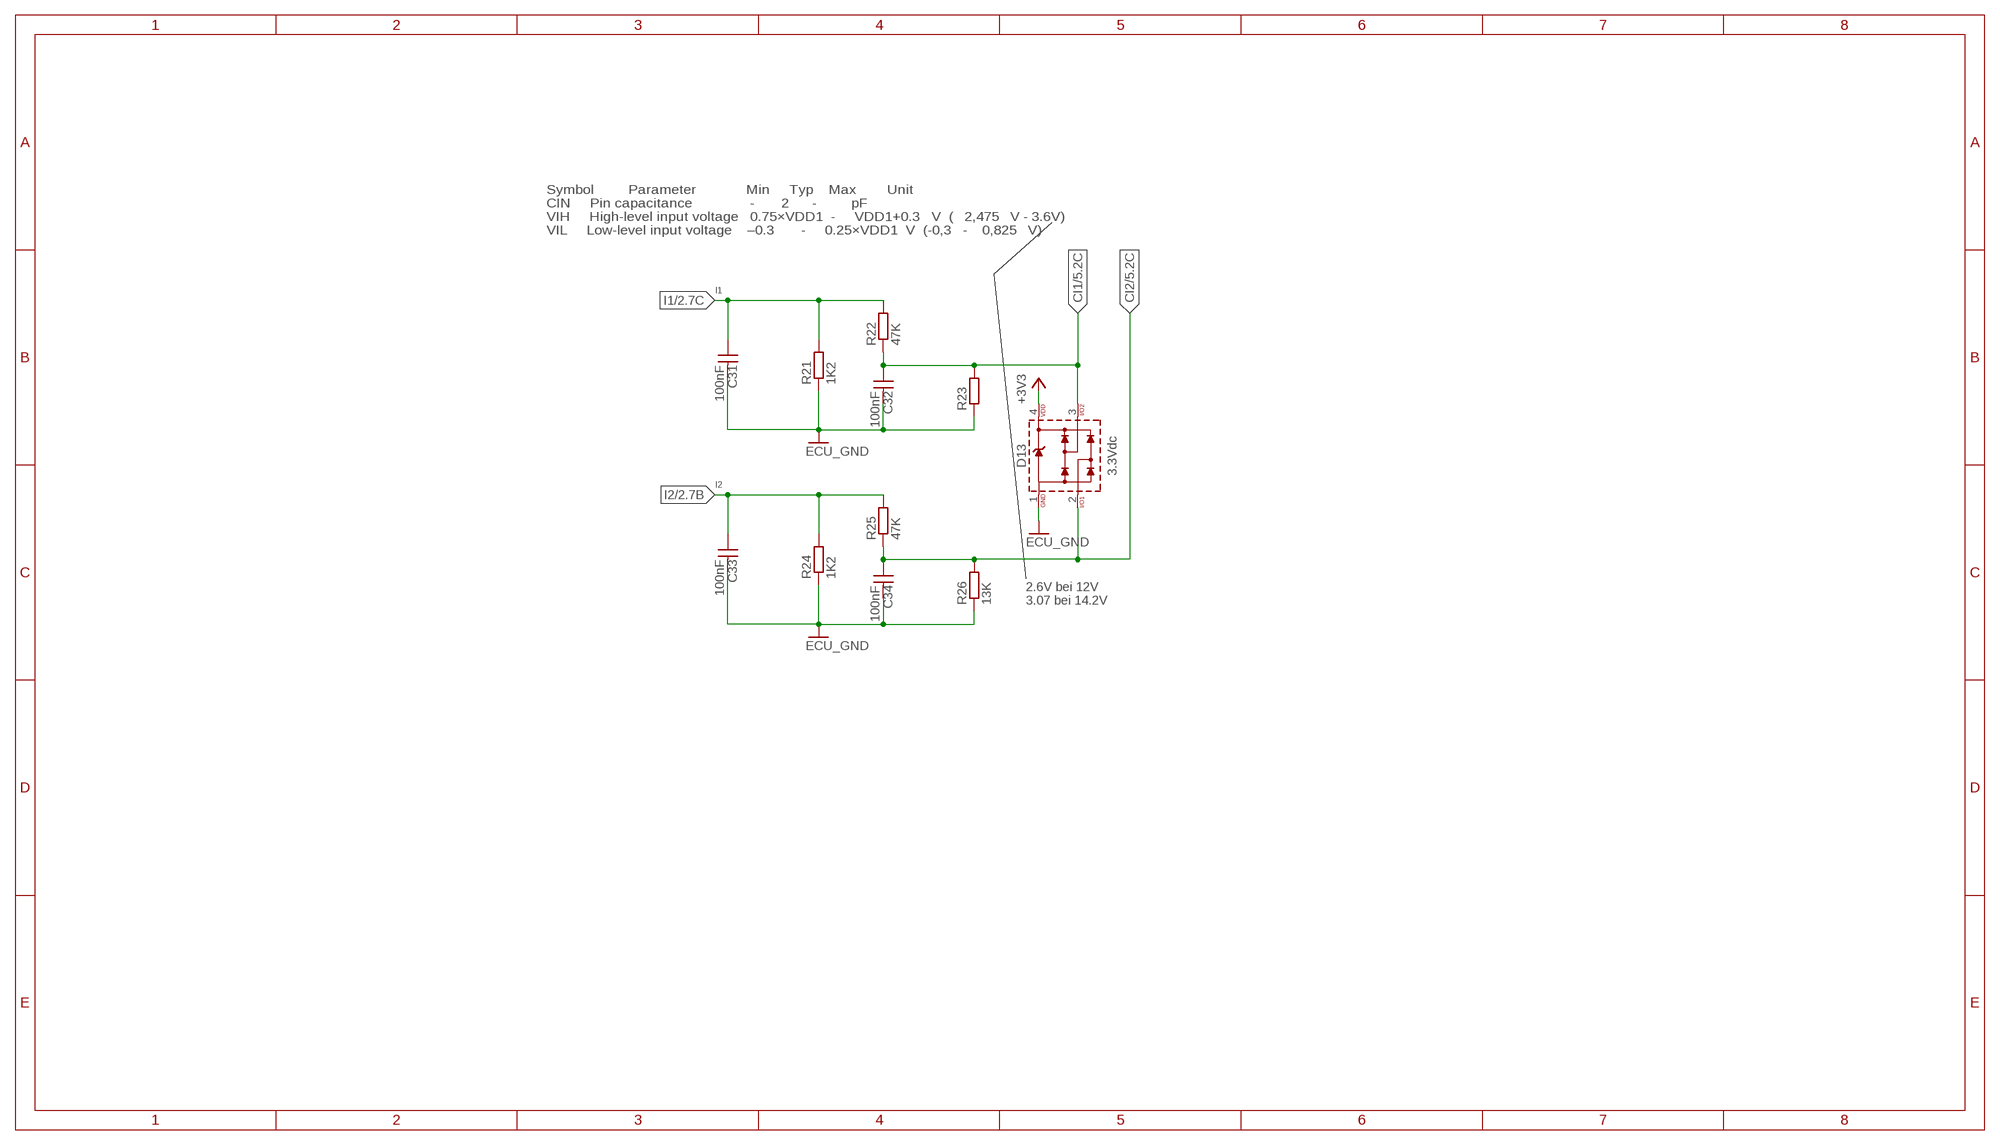
[diagram p8: schematic, sheet 9]

### Parts
C31  100nF  WCAP-CSGP_1206_H0.8_885012208087_50V(DC)  [WCAP-CSGP_1206_H0.8]
C32  100nF  WCAP-CSGP_1206_H0.8_885012208087_50V(DC)  [WCAP-CSGP_1206_H0.8]
C33  100nF  WCAP-CSGP_1206_H0.8_885012208087_50V(DC)  [WCAP-CSGP_1206_H0.8]
C34  100nF  WCAP-CSGP_1206_H0.8_885012208087_50V(DC)  [WCAP-CSGP_1206_H0.8]
D13  3.3Vdc  WE-TVS-HS_SOT143-4L_8240136  [WE-TVS_SOT143-4L]
R21  1K2  R-EU_R1206  [R1206]
R22  47K  R-EU_R1206  [R1206]
R23  13K  R-EU_R1206  [R1206]
R24  1K2  R-EU_R1206  [R1206]
R25  47K  R-EU_R1206  [R1206]
R26  13K  R-EU_R1206  [R1206]

### Nets
+3V3: D13.4(VDD) ; also sheet 4,5,6,10,11,12
CI1: C32.1 D13.3 R22.1 R23.2 ; also sheet 5,6
CI2: C34.1 D13.2 R25.1 R26.2 ; also sheet 5,6
ECU_GND [GND]: C31.2 C32.2 C33.2 C34.2 D13.1(GND) R21.1 R23.1 R24.1 R26.1 ; also sheet 2,3,4,5,6,7,8,10,11,12
I1: C31.1 R21.2 R22.2 ; also sheet 2
I2: C33.1 R24.2 R25.2 ; also sheet 2

### Notes on the sheet
- Symbol         Parameter             Min     Typ    Max        Unit
  CIN     Pin capacitance               -       2      -         pF
  VIH     High-level input voltage   0.75×VDD1  -     VDD1+0.3   V  (‭2,475‬V - 3.6V)
  VIL     Low-level input voltage    –0.3       -     0.25×VDD1  V  (-0,3   - ‭0,825‬V)
- 2.6V bei 12V
  3.07 bei 14.2V

## Sheet 10 of 12
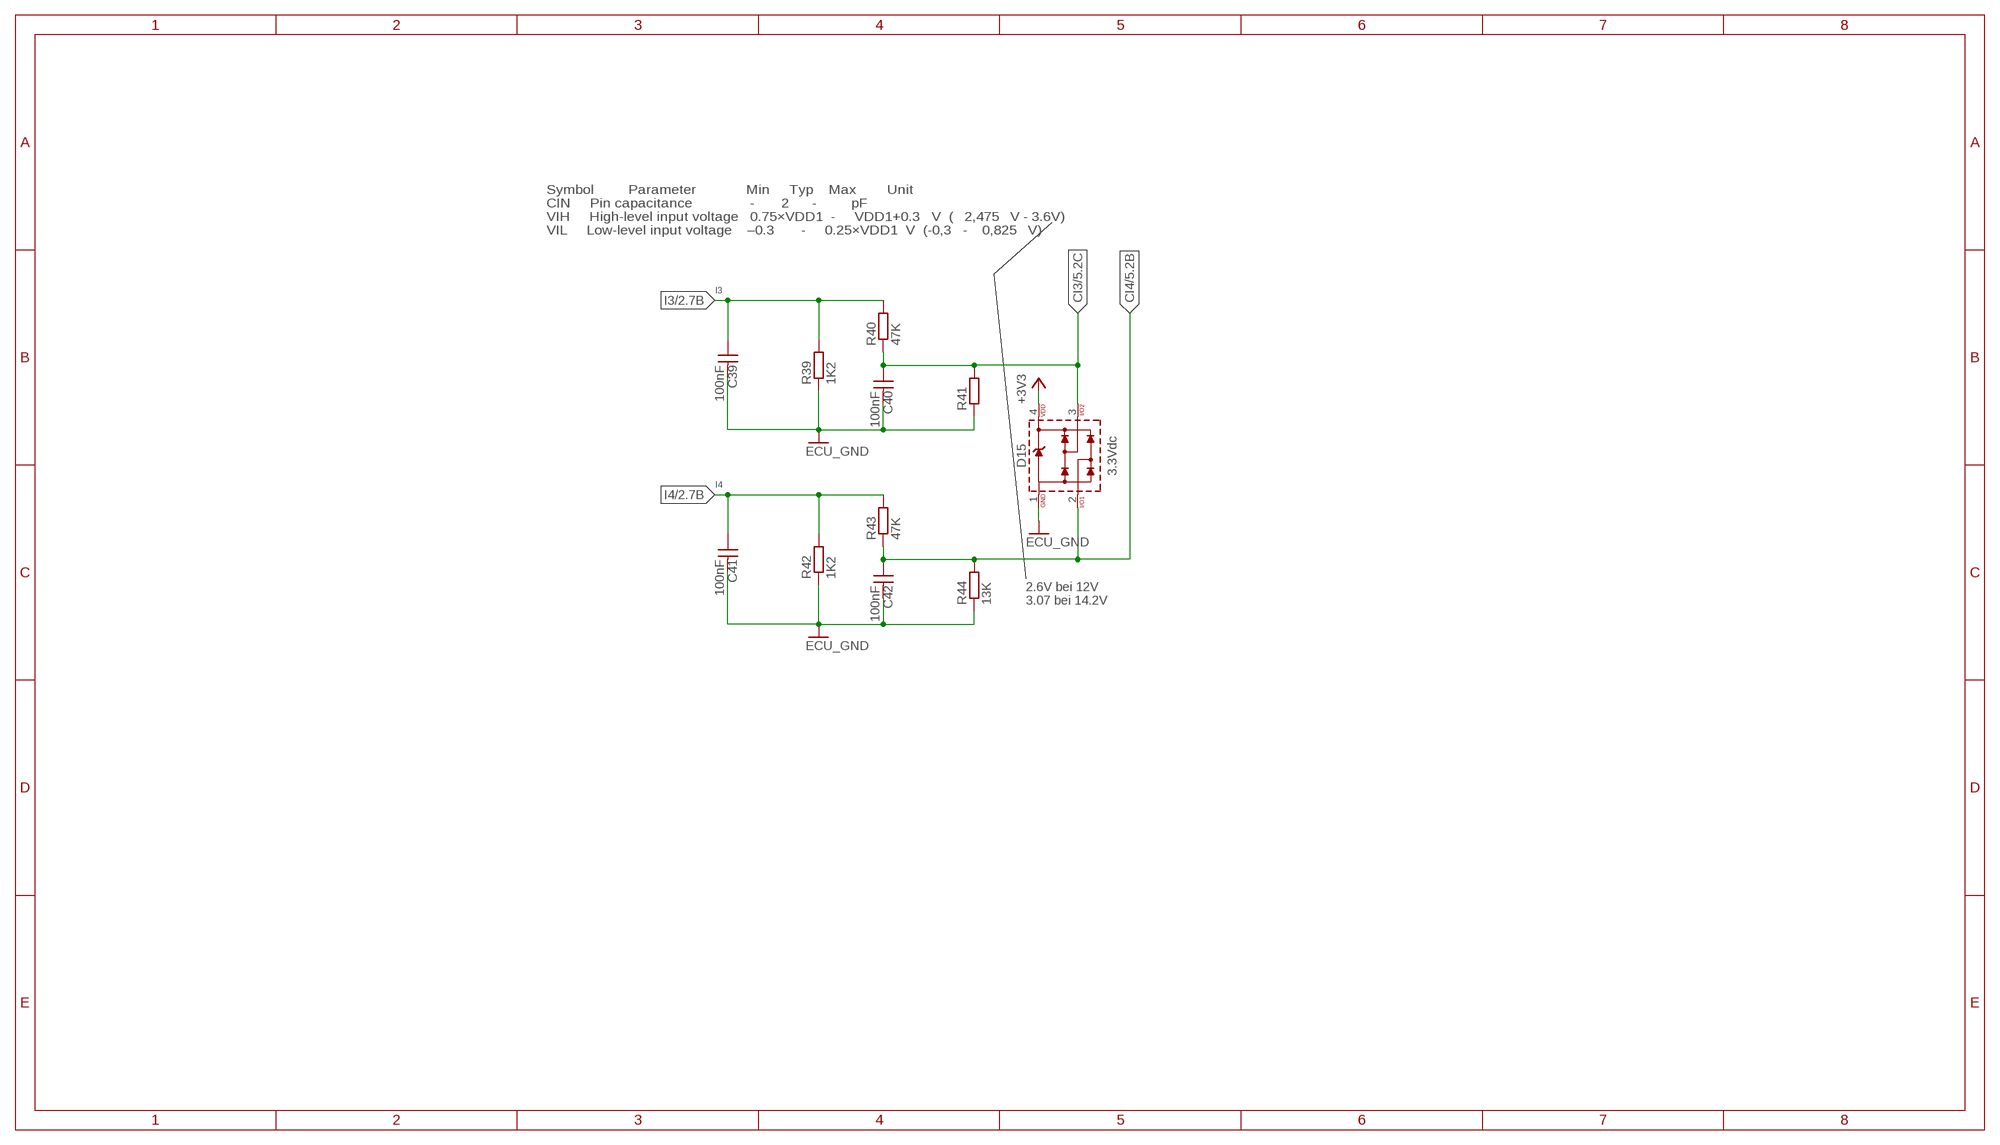
[diagram p9: schematic, sheet 10]

### Parts
C39  100nF  WCAP-CSGP_1206_H0.8_885012208087_50V(DC)  [WCAP-CSGP_1206_H0.8]
C40  100nF  WCAP-CSGP_1206_H0.8_885012208087_50V(DC)  [WCAP-CSGP_1206_H0.8]
C41  100nF  WCAP-CSGP_1206_H0.8_885012208087_50V(DC)  [WCAP-CSGP_1206_H0.8]
C42  100nF  WCAP-CSGP_1206_H0.8_885012208087_50V(DC)  [WCAP-CSGP_1206_H0.8]
D15  3.3Vdc  WE-TVS-HS_SOT143-4L_8240136  [WE-TVS_SOT143-4L]
R39  1K2  R-EU_R1206  [R1206]
R40  47K  R-EU_R1206  [R1206]
R41  13K  R-EU_R1206  [R1206]
R42  1K2  R-EU_R1206  [R1206]
R43  47K  R-EU_R1206  [R1206]
R44  13K  R-EU_R1206  [R1206]

### Nets
+3V3: D15.4(VDD) ; also sheet 4,5,6,9,11,12
CI3: C40.1 D15.3 R40.1 R41.2 ; also sheet 5,6
CI4: C42.1 D15.2 R43.1 R44.2 ; also sheet 5,6
ECU_GND [GND]: C39.2 C40.2 C41.2 C42.2 D15.1(GND) R39.1 R41.1 R42.1 R44.1 ; also sheet 2,3,4,5,6,7,8,9,11,12
I3: C39.1 R39.2 R40.2 ; also sheet 2
I4: C41.1 R42.2 R43.2 ; also sheet 2

### Notes on the sheet
- Symbol         Parameter             Min     Typ    Max        Unit
  CIN     Pin capacitance               -       2      -         pF
  VIH     High-level input voltage   0.75×VDD1  -     VDD1+0.3   V  (‭2,475‬V - 3.6V)
  VIL     Low-level input voltage    –0.3       -     0.25×VDD1  V  (-0,3   - ‭0,825‬V)
- 2.6V bei 12V
  3.07 bei 14.2V

## Sheet 11 of 12
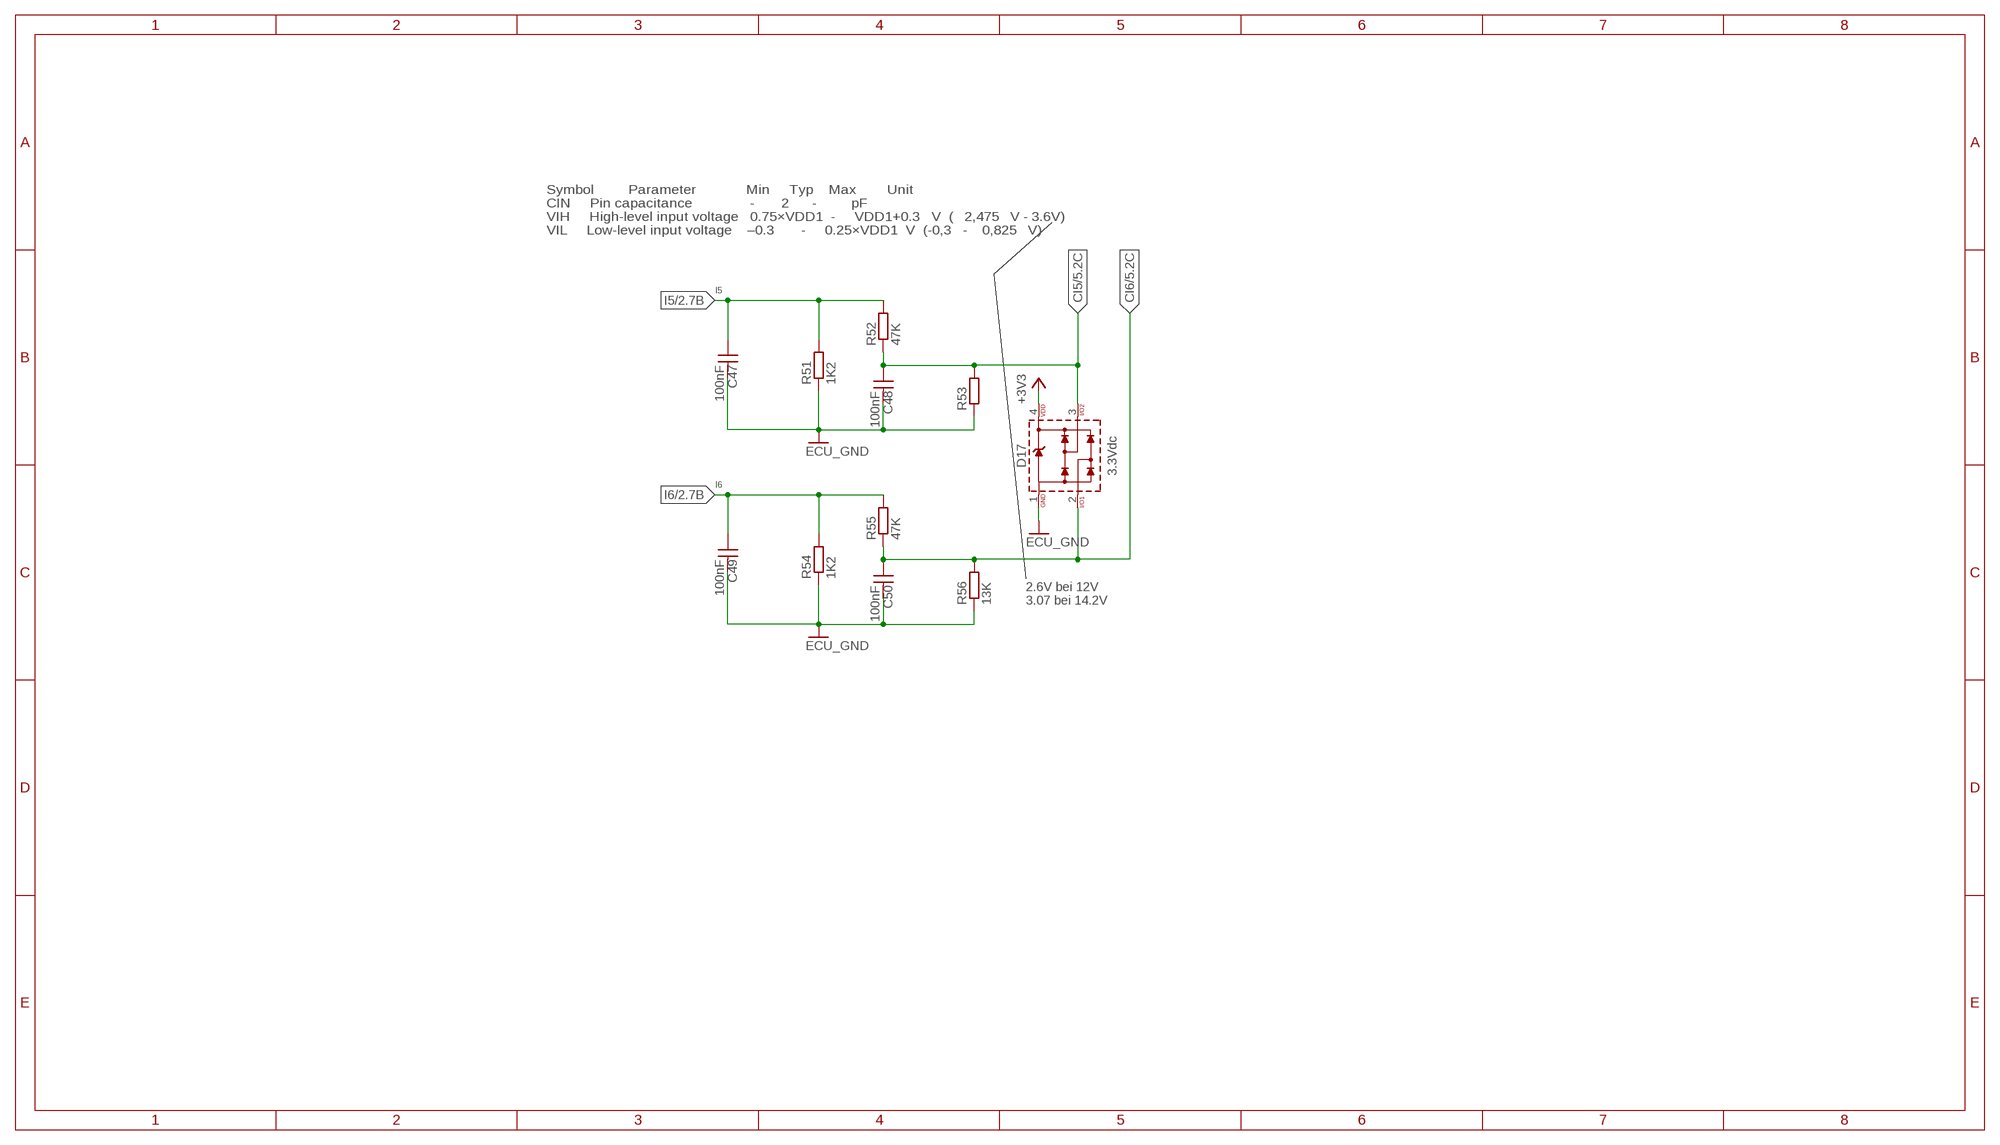
[diagram p10: schematic, sheet 11]

### Parts
C47  100nF  WCAP-CSGP_1206_H0.8_885012208087_50V(DC)  [WCAP-CSGP_1206_H0.8]
C48  100nF  WCAP-CSGP_1206_H0.8_885012208087_50V(DC)  [WCAP-CSGP_1206_H0.8]
C49  100nF  WCAP-CSGP_1206_H0.8_885012208087_50V(DC)  [WCAP-CSGP_1206_H0.8]
C50  100nF  WCAP-CSGP_1206_H0.8_885012208087_50V(DC)  [WCAP-CSGP_1206_H0.8]
D17  3.3Vdc  WE-TVS-HS_SOT143-4L_8240136  [WE-TVS_SOT143-4L]
R51  1K2  R-EU_R1206  [R1206]
R52  47K  R-EU_R1206  [R1206]
R53  13K  R-EU_R1206  [R1206]
R54  1K2  R-EU_R1206  [R1206]
R55  47K  R-EU_R1206  [R1206]
R56  13K  R-EU_R1206  [R1206]

### Nets
+3V3: D17.4(VDD) ; also sheet 4,5,6,9,10,12
CI5: C48.1 D17.3 R52.1 R53.2 ; also sheet 5,6
CI6: C50.1 D17.2 R55.1 R56.2 ; also sheet 5,6
ECU_GND [GND]: C47.2 C48.2 C49.2 C50.2 D17.1(GND) R51.1 R53.1 R54.1 R56.1 ; also sheet 2,3,4,5,6,7,8,9,10,12
I5: C47.1 R51.2 R52.2 ; also sheet 2
I6: C49.1 R54.2 R55.2 ; also sheet 2

### Notes on the sheet
- Symbol         Parameter             Min     Typ    Max        Unit
  CIN     Pin capacitance               -       2      -         pF
  VIH     High-level input voltage   0.75×VDD1  -     VDD1+0.3   V  (‭2,475‬V - 3.6V)
  VIL     Low-level input voltage    –0.3       -     0.25×VDD1  V  (-0,3   - ‭0,825‬V)
- 2.6V bei 12V
  3.07 bei 14.2V

## Sheet 12 of 12
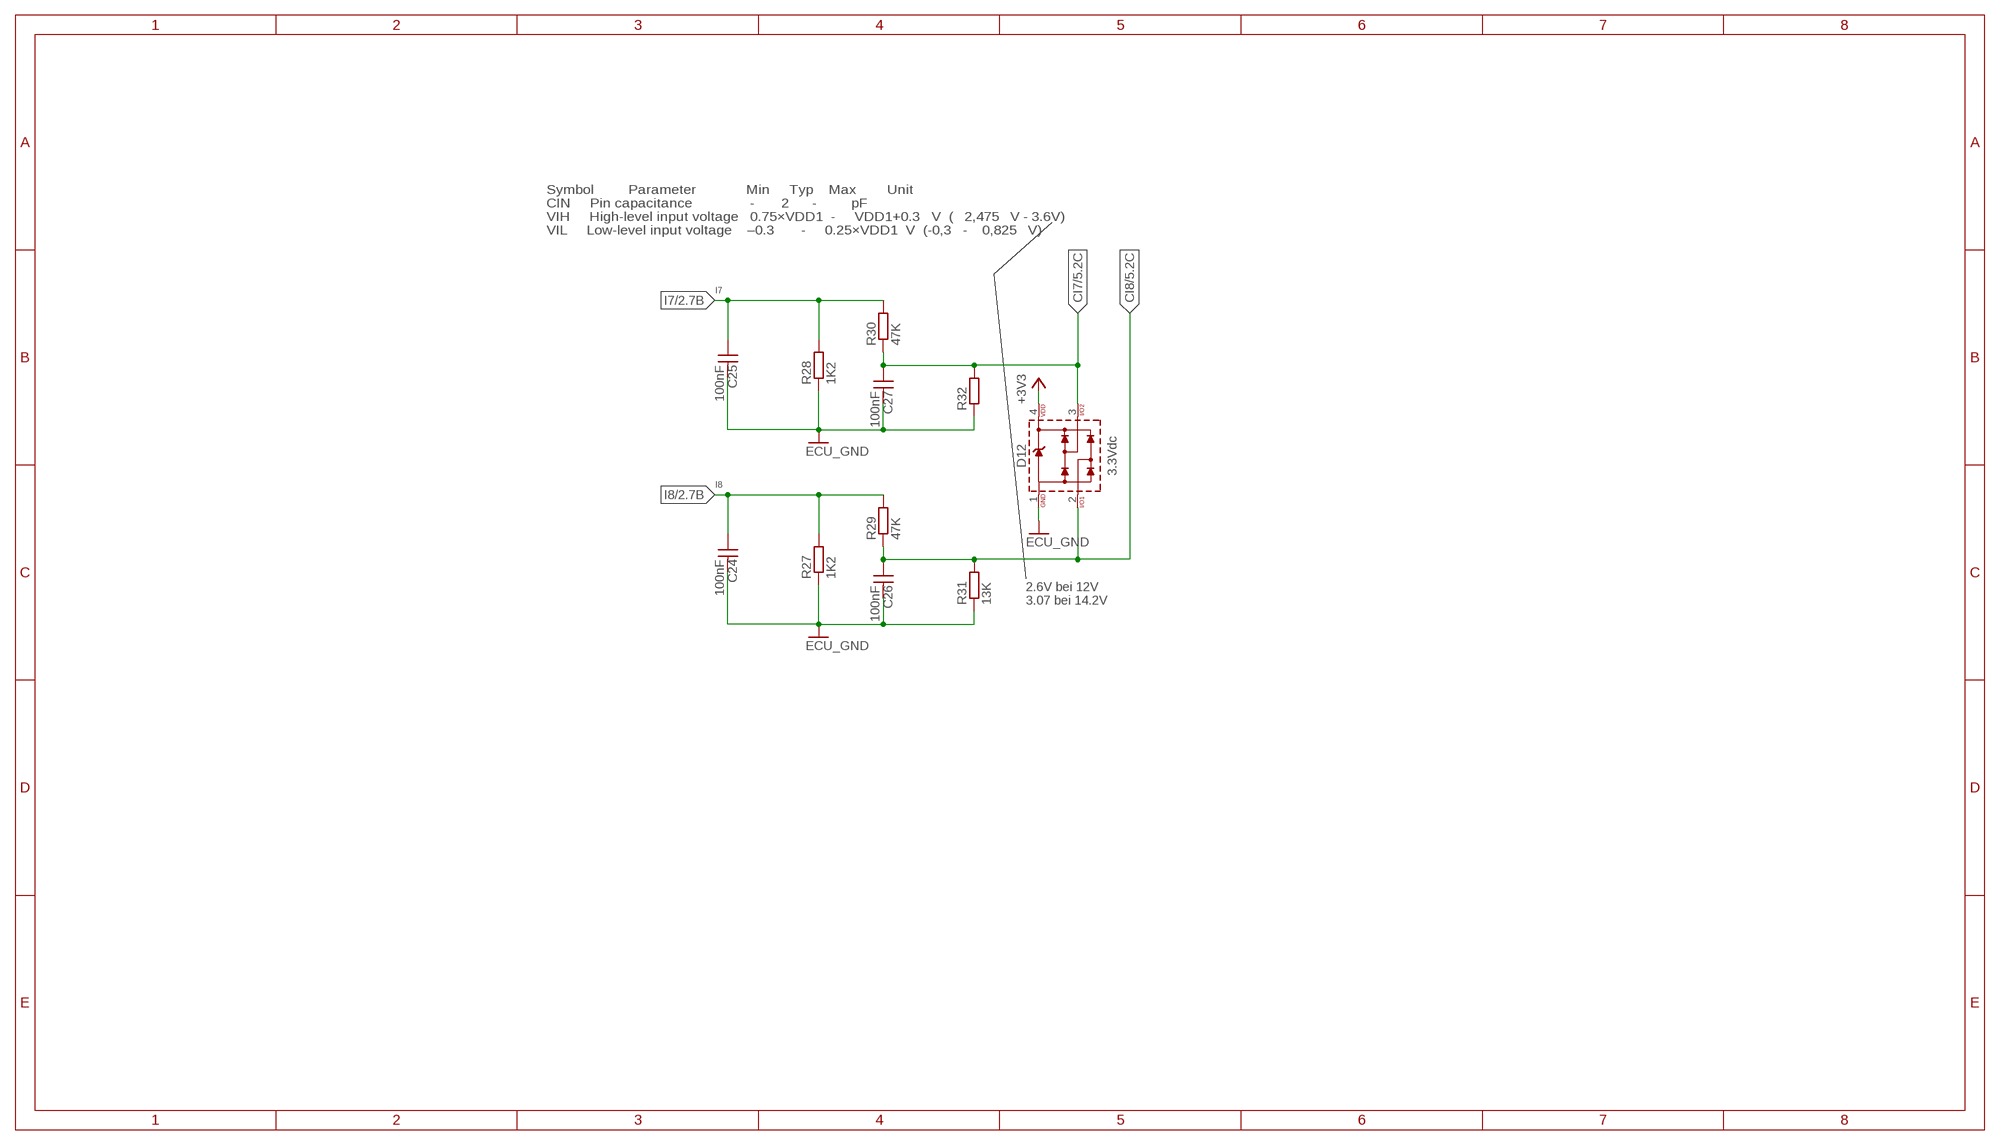
[diagram p11: schematic, sheet 12]

### Parts
C24  100nF  WCAP-CSGP_1206_H0.8_885012208087_50V(DC)  [WCAP-CSGP_1206_H0.8]
C25  100nF  WCAP-CSGP_1206_H0.8_885012208087_50V(DC)  [WCAP-CSGP_1206_H0.8]
C26  100nF  WCAP-CSGP_1206_H0.8_885012208087_50V(DC)  [WCAP-CSGP_1206_H0.8]
C27  100nF  WCAP-CSGP_1206_H0.8_885012208087_50V(DC)  [WCAP-CSGP_1206_H0.8]
D12  3.3Vdc  WE-TVS-HS_SOT143-4L_8240136  [WE-TVS_SOT143-4L]
R27  1K2  R-EU_R1206  [R1206]
R28  1K2  R-EU_R1206  [R1206]
R29  47K  R-EU_R1206  [R1206]
R30  47K  R-EU_R1206  [R1206]
R31  13K  R-EU_R1206  [R1206]
R32  13K  R-EU_R1206  [R1206]

### Nets
+3V3: D12.4(VDD) ; also sheet 4,5,6,9,10,11
CI7: C27.1 D12.3 R30.1 R32.2 ; also sheet 5,6
CI8: C26.1 D12.2 R29.1 R31.2 ; also sheet 5,6
ECU_GND [GND]: C24.2 C25.2 C26.2 C27.2 D12.1(GND) R27.1 R28.1 R31.1 R32.1 ; also sheet 2,3,4,5,6,7,8,9,10,11
I7: C25.1 R28.2 R30.2 ; also sheet 2
I8: C24.1 R27.2 R29.2 ; also sheet 2

### Notes on the sheet
- Symbol         Parameter             Min     Typ    Max        Unit
  CIN     Pin capacitance               -       2      -         pF
  VIH     High-level input voltage   0.75×VDD1  -     VDD1+0.3   V  (‭2,475‬V - 3.6V)
  VIL     Low-level input voltage    –0.3       -     0.25×VDD1  V  (-0,3   - ‭0,825‬V)
- 2.6V bei 12V
  3.07 bei 14.2V

## Library data of the parts
C1-C3 C5 C6 C13 C17-C20 = Wurth_Capacitors_WCAP-CSGP:WCAP-CSGP_0805_H0.8: WCAP-CSGP MLCCs 0805 Characteristics General purpose product series High performance ceramic High electrical precision and stability ceramic especially for NP0 Minimal aging especially for NP0 Mounting style: SMT-Chip Ceramic: NP0 (Class I), X5R (Class II), X7R (Class II) Temperature coefficient: ±30 ppm/°C; ±0.54 % for NP0 ±15 % for X5R and X7R Operating temperature: -55 °C up to + 125 °C for NP0 and X7R -55 °C up to + 85 °C for X5R Termination: Cu/Ni/Sn Recommended soldering: Reflow soldering Wave soldering for size 0603 Wave soldering for size 0805 (only valid for the thickness ≤0.85 mm) Applications Temperature compensation (NP0) Coupling Decoupling Bypass Smoothing Filtering Resonant circuit <https://www.we-online.com/catalog/media/o177837v209%20MLCC_GRP_all.jpg> Details see: https://www.we-online.com/catalog/en/pbs/capacitors/multilayer_ceramic_chip_capacitors/mlcc_general_purpose Updated by Ella Wu 2022-02-15 2022(C) Würth Elektronik; CERAMIC-TYPE: X7R Class II; DATASHEET-URL: https://www.we-online.com/redexpert/spec/885012207098?ae; DF: 2.5%; HEIGHT: 0.8mm; LENGTH: 2mm; MOUNT: SMT; OPERATING-TEMPERATURE: -55 up to +125 °C; PART-NUMBER: 885012207098; QMIN: -; RISO: 5GOhm; SIZE: 0805; VR: 50V(DC); WIDTH: 1.25mm
C4 C7-C9 C14 C16 C21 C22 = Wurth_Capacitors_WCAP-CSGP:WCAP-CSGP_0805_H0.8: WCAP-CSGP MLCCs 0805 Characteristics General purpose product series High performance ceramic High electrical precision and stability ceramic especially for NP0 Minimal aging especially for NP0 Mounting style: SMT-Chip Ceramic: NP0 (Class I), X5R (Class II), X7R (Class II) Temperature coefficient: ±30 ppm/°C; ±0.54 % for NP0 ±15 % for X5R and X7R Operating temperature: -55 °C up to + 125 °C for NP0 and X7R -55 °C up to + 85 °C for X5R Termination: Cu/Ni/Sn Recommended soldering: Reflow soldering Wave soldering for size 0603 Wave soldering for size 0805 (only valid for the thickness ≤0.85 mm) Applications Temperature compensation (NP0) Coupling Decoupling Bypass Smoothing Filtering Resonant circuit <https://www.we-online.com/catalog/media/o177837v209%20MLCC_GRP_all.jpg> Details see: https://www.we-online.com/catalog/en/pbs/capacitors/multilayer_ceramic_chip_capacitors/mlcc_general_purpose Updated by Ella Wu 2022-02-15 2022(C) Würth Elektronik; CERAMIC-TYPE: X7R Class II; DATASHEET-URL: https://www.we-online.com/redexpert/spec/885012207092?ae; DF: 2.5%; HEIGHT: 0.8mm; LENGTH: 2mm; MOUNT: SMT; OPERATING-TEMPERATURE: -55 up to +125 °C; PART-NUMBER: 885012207092; QMIN: -; RISO: 10GOhm; SIZE: 0805; VR: 50V(DC); WIDTH: 1.25mm
C10 = Wurth_Capacitors_WCAP-CSGP:WCAP-CSGP_1210_H2.5: WCAP-CSGP MLCCs 1210 Characteristics General purpose product series High performance ceramic High electrical precision and stability ceramic especially for NP0 Minimal aging especially for NP0 Mounting style: SMT-Chip Ceramic: NP0 (Class I), X5R (Class II), X7R (Class II) Temperature coefficient: ±30 ppm/°C; ±0.54 % for NP0 ±15 % for X5R and X7R Operating temperature: -55 °C up to + 125 °C for NP0 and X7R -55 °C up to + 85 °C for X5R Termination: Cu/Ni/Sn Recommended soldering: Reflow soldering Wave soldering for size 0603 Wave soldering for size 0805 (only valid for the thickness ≤0.85 mm) Applications Temperature compensation (NP0) Coupling Decoupling Bypass Smoothing Filtering Resonant circuit <https://www.we-online.com/catalog/media/o177837v209%20MLCC_GRP_all.jpg> Details see: https://www.we-online.com/catalog/en/pbs/capacitors/multilayer_ceramic_chip_capacitors/mlcc_general_purpose Updated by Ella Wu 2022-02-18 2022(C) Würth Elektronik; CERAMIC-TYPE: X5R Class II; DATASHEET-URL: https://www.we-online.com/redexpert/spec/885012109014?ae; DF: 5%; HEIGHT: 2.5mm; LENGTH: 3.2mm; MOUNT: SMT; OPERATING-TEMPERATURE: -55 up to +85 °C; PART-NUMBER: 885012109014; QMIN: -; RISO: 0.005GOhm; SIZE: 1210; VR: 25V(DC); WIDTH: 2.5mm
C12 = Wurth_Capacitors_WCAP-CSGP:WCAP-CSGP_0805_H1.25: WCAP-CSGP MLCCs 0805 General Purpose Characteristics General purpose product series High performance ceramic High electrical precision and stability ceramic especially for NP0 Minimal aging especially for NP0 Mounting style: SMT-Chip Ceramic: NP0 (Class I), X5R (Class II), X7R (Class II) Temperature coefficient: ±30 ppm/°C; ±0.54 % for NP0 ±15 % for X5R and X7R Operating temperature: -55 °C up to + 125 °C for NP0 and X7R -55 °C up to + 85 °C for X5R Termination: Cu/Ni/Sn Recommended soldering: Reflow soldering Wave soldering for size 0603 Wave soldering for size 0805 (only valid for the thickness ≤0.85 mm) Applications Temperature compensation (NP0) Coupling Decoupling Bypass Smoothing Filtering Resonant circuit <https://www.we-online.com/catalog/media/o177837v209%20MLCC_GRP_all.jpg> Details see: https://www.we-online.com/catalog/en/pbs/capacitors/multilayer_ceramic_chip_capacitors/mlcc_general_purpose Updated by Ella Wu 2024-01-18 2024(C) Würth Elektronik; CERAMIC-TYPE: X5R Class II; DATASHEET-URL: https://www.we-online.com/redexpert/spec/885012107011?ae; DF: 10%; HEIGHT: 1.25mm; LENGTH: 2mm; MOUNT: SMT; OPERATING-TEMPERATURE: -55 up to +85 °C; PART-NUMBER: 885012107011; QMIN: -; RISO: 0.005GOhm; SIZE: 0805; VR: 10V(DC); WIDTH: 1.25mm
C15 = Wurth_Capacitors_WCAP-CSGP:WCAP-CSGP_0805_H0.8: WCAP-CSGP MLCCs 0805 Characteristics General purpose product series High performance ceramic High electrical precision and stability ceramic especially for NP0 Minimal aging especially for NP0 Mounting style: SMT-Chip Ceramic: NP0 (Class I), X5R (Class II), X7R (Class II) Temperature coefficient: ±30 ppm/°C; ±0.54 % for NP0 ±15 % for X5R and X7R Operating temperature: -55 °C up to + 125 °C for NP0 and X7R -55 °C up to + 85 °C for X5R Termination: Cu/Ni/Sn Recommended soldering: Reflow soldering Wave soldering for size 0603 Wave soldering for size 0805 (only valid for the thickness ≤0.85 mm) Applications Temperature compensation (NP0) Coupling Decoupling Bypass Smoothing Filtering Resonant circuit <https://www.we-online.com/catalog/media/o177837v209%20MLCC_GRP_all.jpg> Details see: https://www.we-online.com/catalog/en/pbs/capacitors/multilayer_ceramic_chip_capacitors/mlcc_general_purpose Updated by Ella Wu 2022-02-15 2022(C) Würth Elektronik; CERAMIC-TYPE: X7R Class II; DATASHEET-URL: https://www.we-online.com/redexpert/spec/885012207096?ae; DF: 2.5%; HEIGHT: 0.8mm; LENGTH: 2mm; MOUNT: SMT; OPERATING-TEMPERATURE: -55 up to +125 °C; PART-NUMBER: 885012207096; QMIN: -; RISO: 10GOhm; SIZE: 0805; VR: 50V(DC); WIDTH: 1.25mm
C23 = Wurth_Capacitors_WCAP-ASLI:WCAP-ASLI_12.5X14: WCAP-ASLI Aluminium Electrolytic Capacitors Low Impedance +105 °C Characteristics Low impedance product series Mounting style: V-Chip SMT Capacitance range: 0.1 µF ‒ 6800 µF Capacitance tolerance: ±20 % Voltage range (UR): 6.3 ‒ 100 V(DC) Operating temperature: -55 °C up to +105 °C Endurance: 2000 h @ +105 °C Dimensions (DxL) in mm: 4.0 x 5.5 up to 16.0 x 17.0 Recommended soldering: Reflow soldering Applications Low impedance, especially for filtering applications Input and output capacitor for switched-mode power supply Filtering Smoothing e.g. DC/DC converter, AC/DC converter, satellite receiver, control panel <https://www.we-online.com/catalog/media/o14723v209%20Family_WCAP-ASLI.jpg> Details see: https://www.we-online.com/catalog/en/WCAP-ASLI/ Updated by yingchun,Shan;2020-03-03 2020(C) Würth Elektronik; DATASHEET-URL: https://www.we-online.com/catalog/datasheet/865080662019.pdf; DF: 12%; DIAMETER: 12.5mm; I-LEAK: 165uA; I-RIPPLE: 800mA; L: 14mm; OPERATING-TEMPERATURE: -55 °C up to +105 °C; PART-NUMBER: 865080662019; TECHNICAL-REFERENCE: ASEH140331M050DVCTGB000; VR: 50V(DC)
C24-C27 C31-C34 C39-C42 C47-C50 = Wurth_Capacitors_WCAP-CSGP:WCAP-CSGP_1206_H0.8: WCAP-CSGP MLCCs 1206 Characteristics General purpose product series High performance ceramic High electrical precision and stability ceramic especially for NP0 Minimal aging especially for NP0 Mounting style: SMT-Chip Ceramic: NP0 (Class I), X5R (Class II), X7R (Class II) Temperature coefficient: ±30 ppm/°C; ±0.54 % for NP0 ±15 % for X5R and X7R Operating temperature: -55 °C up to + 125 °C for NP0 and X7R -55 °C up to + 85 °C for X5R Termination: Cu/Ni/Sn Recommended soldering: Reflow soldering Wave soldering for size 0603 Wave soldering for size 0805 (only valid for the thickness ≤0.85 mm) Applications Temperature compensation (NP0) Coupling Decoupling Bypass Smoothing Filtering Resonant circuit <https://www.we-online.com/catalog/media/o177837v209%20MLCC_GRP_all.jpg> Details see: https://www.we-online.com/catalog/en/pbs/capacitors/multilayer_ceramic_chip_capacitors/mlcc_general_purpose Updated by yingchun,Shan;2020-03-09 2020(C) Würth Elektronik; CERAMIC-TYPE: X7R Class II; DATASHEET-URL: https://www.we-online.com/redexpert/spec/885012208087?ae; DF: 2.5%; HEIGHT: 0.8mm; LENGTH: 3.2mm; MOUNT: SMT; OPERATING-TEMPERATURE: -55 up to +125 °C; PART-NUMBER: 885012208087; QMIN: -; RISO: 5GOhm; SIZE: 1206; VR: 50V(DC); WIDTH: 1.6mm
D0 D5 = Wurth_EMC Components_WE-TVSP:WE-TVSP_DO-214AB_3000W_BI: WE-TVSP Power TVS Diode Characteristics Low Profile Package Glass passivated Juction Excellent clamping capability Fast response time MSL Level 1, per J-STD-020 Classification of the plastic case: UL 94 V-0 Safety certification UL 497B, E478010 Identical design: - DO-214AC = SMAJ - DO-214AA = SMBJ - DO-214AB = SMCJ/SMDJ Applications Ideal to protect the I/O Interfaces, Bus Voltage and other circuits of sensetive electronic equipment against voltage transiensts <https://www.we-online.com/catalog/media/o55793v209%20WE-TVSP_600W-3000W_D0214AA_4C.jpg> Details see: https://www.we-online.com/catalog/en/WE-TVSP/ Updated by Ella Wu 2020-07-20 2020 (C) Würth Elektronik; DATASHEET-URL: https://www.we-online.com/catalog/datasheet/824551331.pdf; IPEAK: 56.3A; MOUNT: SMT; PART-NUMBER: 824551331; PDISS: 3000W; VBR: 38.65V; VCLAMP: 53.3V
D1-D4 D7-D10 = Wurth_LEDs_WL-SMTW:WL-SMTW_3528: WL-SMTW SMT Mono-color TOP LED Waterclear Characteristics Low energy consumption High reliability Low current requirement Fast switching No UV/IR radiation Slim Miniature size Flexibility in design Top view LED PLCC 2 white package Compact package outline, ideal for miniature applications Variety of colors Applications Signage and indirect illumination Flat lamp Indicator and backlight in telecommunication Consumer application: dash-board, telephone or A/V equipments Flat backlight for LCDs, switches and symbols Optical indicators Indoor and outdoor displays Scanner Backlight in LCD, cellular phones, switches, keys, displays lluminated advertising, panel Lighting device: indicator, general lighting Camera flash, hand carrier flash Coupling into light guides <https://www.we-online.com/catalog/media/o14908v209%20WL-SMTW_150285BSxxx.jpg> Details see: www.we-online.com/catalog/WL-SMTW <www.we-online.com/catalog/WL-SMTW/?utm_source=eagle_model&utm_medium=description_link&utm_campaign=eisos_eagle> Updated by Ella 2022-06-21 2022(C) Wurth Elektronik; CHIP-TECHNOLOGY: AlInGaP; DATASHEET-URL: https://www.we-online.com/redexpert/spec/150141VS73100?ae; DOMINANT-WAVELENGTH: 570nm; EMITTING-COLOR: Bright Green; FORWARD-VOLTAGE: 2V; LUMINOUS-INTENSITY: 90mcd; MOUNT: SMT; PART-NUMBER: 150141VS73100; PEAK-WAVELENGTH: 572nm; VIEWING-ANGLE: 120°
D006 = fliegl-elektronik:MBRS3*0T3: SCHOTTKY BARRIER RECTIFIER 3.0 AMPERES 20, 30, 40 VOLT Source: MBRS340T3-D.pdf; ARTIKEL_NR: 513891
D11 = Wurth_EMC Components_WE-TVS:WE-TVS_SOT23-3L_824094024: WE-TVS TVS Diode – Standard Series Characteristics Fast turn-on Low clamping voltage High ESD withstand voltage Uni- or bidirectional protection Small package Epoxy flame resistant UL94 V-0 Applications DC power supply USB Power Delivery (PD) Headsets and accessories PDAs Digital cameras MP3-Player Touch Panels Notebooks ESD, EFT and Surge Protection ESD protection in accordance with EN 61000-4-2 – 8 kV contact discharge – 15 kV air discharge <https://www.we-online.com/catalog/media/o106433v209%20Family_WE-TVS_Standard.jpg> Details see: https://www.we-online.com/catalog/en/WE-TVS Created by Ella Wu 2021-12-15 2021 (C) Wurth Elektronik; C-CH: 38pF; CHANNELS: 2; DATASHEET-URL: https://www.we-online.com/catalog/datasheet/824094024.pdf; IPEAK: 6A; MOUNT: SMT; PART-NUMBER: 824094024; VBR: 26.2V
D12 D13 D15 D17 = Wurth_EMC Components_WE-TVS:WE-TVS-HS_SOT143-4L_8240136: WE-TVS TVS Diode – High Speed Series Characteristics Low clamping voltage Sturdy design Very low capacitance Flow Thru Design for a simple layout Rail to Rail protection Epoxy flame resistant UL94-V0 RoHS, REACH and free of halogens Applications Very fast data lines USB 2.0 Ethernet PoE VGA Sim Cards Keypads HS = High Speed <https://www.we-online.com/catalog/media/o14883v209%20Family_WE-TVS_HIGHSPEED.jpg> Details see: https://www.we-online.com/catalog/en/WE-TVS-HS Updated by Ella Wu 2019-07-12 2019 (C) Wurth Elektronik; C-CH: 3pF; CHANNELS: 2+1; DATASHEET-URL: https://www.we-online.com/catalog/datasheet/8240136.pdf; IPEAK: 12A; MOUNT: SMT; PART-NUMBER: 8240136; VBR: 4.5V
D014 D016 D018-D023 = fliegl-elektronik:GS1*-L: 1.0 Amp Glass Passivated Rectifier 50 to 1000 Volts Datenblatt <http://www.mouser.com/ds/2/258/GS1A-L~GS1M-L(DO-214AC)-257344.pdf>; ARTIKEL_NR: 502724; OC: Farnell 1924364
ESP32-J1 ESP32-J3 = Wurth_Connectors_WR-PHD:6130XX11821_61302211821: WR-PHD 2.54 mm Socket Header Article Properties Pins 2 unitless; 3 unitless; 4 unitless; 5 unitless; 6 unitless; 7 unitless; 8 unitless; 9 unitless; 10 unitless; 12 unitless; 13 unitless; 14 unitless; 15 unitless; 16 unitless; 18 unitless; 20 unitless; 22 unitless; 24 unitless; 32 unitless; 36 unitless; 40 unitless General Information Operating Temperature -40 °C up to +105 °C Pitch 2.54 mm Durability 25 Mating cycles; 500 Mating cycles Rows Single Gender Socket Header Type Straight Material Properties Insulator Material PBT Insulator Flammability Rating UL94 V-0 Contact Material Copper Alloy Contact Plating Gold Contact Type Stamped Certification UL Approval E323964 Packaging Properties Packaging Tray Electrical Properties Withstanding Voltage 500 V (AC) Contact Resistance 20 mΩ RISO 1000 MΩ <https://www.we-online.com/components/media/o33218v209%20Family_WR-PHD_613xxx11821.jpg> Details see: www.we-online.com/en/components/products/PHD_2_54_SOCKET_HEADER_6130XX11821 <www.we-online.com/catalog/PHD_2_54_SOCKET_HEADER_6130XX11821/?utm_source=eagle_model&utm_medium=description_link&utm_campaign=eisos_eagle> Updated by Yingchun,Shan 2019-10-21 2019 (C) Würth Elektronik; DATASHEET-URL: https://www.we-online.com/redexpert/spec/61302211821?ae; GENDER: Socket Header; IR: 3A; MOUNT: THT; PACKAGING: Tray; PART-NUMBER: 61302211821; PINS: 22; PITCH: 2.54mm; ROWS: Single; TYPE: Straight
G1 = IFX27001TF V50:IFX27001TF_V50: IFX27001TF V50 INF-PG-TO252-3-11_N Linear Voltage Regulator, 4.7 to 40 V Supply, Fixed/Adjustable Output, -40 to 125 degC, PG-TO252-3, Reel, Green
J1 J7 J13 = Wurth_Connectors_WR-FAST:638207222005: WR-FAST 5.08 mm THT Male Header Vertical Blade 2863 KIND PROPERTIES Pitch 5.08 mm Gender Male MATERIAL PROPERTIES Insulator Material PC Insulator Flammability Rating UL94 V-0 Insulator Color Black Contact Material Steel Contact Plating Tin Contact Type Stamped GENERAL INFORMATION Operating Temperature -30 up to +120 °C Working Voltage 300 V (AC) Withstanding Voltage 1600 V (AC) Contact Resistance 20 mΩ RISO 5 MΩ IR 16 A CERTIFICATION cULus Approval E150931 PACKAGING PROPERTIES Packaging Box <https://www.we-online.com/catalog/media/o165124v209%20Family_ConFAST_638207222004.jpg> Details see: https://www.we-online.com/catalog/en/FAST_5_08_THT_MALE_VERTICAL_6382072220XX/ Updated by Ella Wu 2020-08-11 2020(C) Wurth Elektronik; CONTACT-RESISTANCE: 20mOhm; DATASHEET-URL: https://www.we-online.com/catalog/datasheet/638207222005.pdf; GENDER: Male; IR: 16A; MOUNT: THT; PART-NUMBER: 638207222005; PINS: 5; PITCH: 5.08mm; TYPE: Vertical; WORKING-VOLTAGE: 300V(AC)
J2 = Wurth_Connectors_WR-WTB:645004114822: WR-WTB 3.96 mm Male Vertical Locking Header KIND PROPERTIES: Pitch:3.96mm Gender:Male MATERIAL PROPERTIES: Insulator Material :PA66 Insulator Flammability Rating:UL94 V-2 Color:White Contact Material:Copper Alloy Contact Plating:Tin Contact Type:Stamped GENERAL INFORMATION Operating Temperature:-40 up to +105 °C Compliance: RoHS Working Voltage:250 V (AC) Withstanding Voltage:1500 V (AC) Contact Resistance:20 mΩ RISO:1000 MΩ CERTIFICATION UL Approval:E323964 PACKAGING PROPERTIES Packaging:Bag <https://katalog.we-online.com/media/images/v2/o33361v209%20Family_WR-WTB_6450xx114822.jpg> Details see: https://katalog.we-online.com/en/em/WTB_3_96_MALE_LOCKING_HEADER_6450XX114822 Updated by Yingchun,Shan 2019-11-05 2019 (C) Würth Elektronik; CONTACT-RESISTANCE: 20mOhm; DATASHEET-URL: https://www.we-online.com/redexpert/spec/645004114822?ae; GENDER: Male; IR: 7A; L: 15.84mm; MOUNT: THT; PACKAGING: Bag; PART-NUMBER: 645004114822; PCB-CABLE-PANEL: PCB; PINS: 4; PITCH: 3.96mm; TYPE: Vertical; WORKING-VOLTAGE: 250V(AC)
J4 = Wurth_Connectors_WR-PHD:6130XX21121_61300421121: WR-PHD 2.54 mm THT Dual Pin Header ARTICLE PROPERTIES: Pins:4;​ 6;​ 8;​ 10;​ 12;​ 14;​ 16;​ 18;​ 20;​ 22;​ 24;​ 26;​ 28;​ 30;​ 32;​ 34;​ 36;​ 40;​ 44;​ 64;​ 72;​ 80 KIND PROPERTIES: Pitch：2.54 mm Quality Class:3 as per CECC 75 301-802 Rows：Dual Gender：Pin Header Type：Board Stacker MATERIAL PROPERTIES: Insulator Material :PA6T Insulator Flammability Rating:UL94 V-0 Contact Material:Copper Alloy Contact Plating:Gold Contact Type:Stamped GENERAL INFORMATION Operating Temperature:-40 up to +105 °C Compliance:Lead free / RoHS ELECTRICAL PROPERTIES: Rated Current:3 A IR 1:3 A Withstanding Voltage:500 V (AC) Contact Resistance:20 mΩ RISO:1000 MΩ CERTIFICATION UL Approval:E323964 PACKAGING PROPERTIES Packaging:Bag <https://katalog.we-online.com/media/images/v2/o33215v209%20Family_WR-PHD_6130xx21121.jpg> Details see: https://katalog.we-online.com/en/em/PHD_2_54_THT_DUAL_PIN_HEADER_6130XX21121 Updated by Yingchun,Shan 2019-10-16 2019 (C) Würth Elektronik; DATASHEET-URL: https://www.we-online.com/redexpert/spec/61300421121?ae; GENDER: Pin Header; IR: 3A; MOUNT: THT; PACKAGING: Bag; PART-NUMBER: 61300421121; PINS: 4; PITCH: 2.54mm; ROWS: Dual; TYPE: Board Stacker
J5 J9 = 6-pin-tht:6130XX21121_61300621121: WR-PHD 2.54 mm THT Dual Pin Header ARTICLE PROPERTIES: Pins:4;​ 6;​ 8;​ 10;​ 12;​ 14;​ 16;​ 18;​ 20;​ 22;​ 24;​ 26;​ 28;​ 30;​ 32;​ 34;​ 36;​ 40;​ 44;​ 64;​ 72;​ 80 KIND PROPERTIES: Pitch：2.54 mm Quality Class:3 as per CECC 75 301-802 Rows：Dual Gender：Pin Header Type：Board Stacker MATERIAL PROPERTIES: Insulator Material :PA6T Insulator Flammability Rating:UL94 V-0 Contact Material:Copper Alloy Contact Plating:Gold Contact Type:Stamped GENERAL INFORMATION Operating Temperature:-40 up to +105 °C Compliance:Lead free / RoHS ELECTRICAL PROPERTIES: Rated Current:3 A IR 1:3 A Withstanding Voltage:500 V (AC) Contact Resistance:20 mΩ RISO:1000 MΩ CERTIFICATION UL Approval:E323964 PACKAGING PROPERTIES Packaging:Bag <https://katalog.we-online.com/media/images/v2/o33215v209%20Family_WR-PHD_6130xx21121.jpg> Details see: https://katalog.we-online.com/en/em/PHD_2_54_THT_DUAL_PIN_HEADER_6130XX21121 Updated by Yingchun,Shan 2019-10-16 2019 (C) Würth Elektronik; DATASHEET-URL: https://katalog.we-online.com/em/datasheet/61300621121.pdf; GENDER: Pin Header; IR: 3A; MATES: WR-PHD 2.54mm Angled DualSocket Header/Dual Socket Header/Dual Socket Header Bottom Entry/Dual Socket Header Bottom Entry Large/SMT Dual Socket Header/SMT Dual Socket Header Bottom Entry; PACKAGING: Bag; PART-NUMBER: 61300621121; PINS: 6; ROWS: Dual; TYPE: Board Stacker
J8 = Wurth_Connectors_WR-FAST:638207222007: WR-FAST 5.08 mm THT Male Header Vertical Blade 2863 KIND PROPERTIES Pitch 5.08 mm Gender Male MATERIAL PROPERTIES Insulator Material PC Insulator Flammability Rating UL94 V-0 Insulator Color Black Contact Material Steel Contact Plating Tin Contact Type Stamped GENERAL INFORMATION Operating Temperature -30 up to +120 °C Working Voltage 300 V (AC) Withstanding Voltage 1600 V (AC) Contact Resistance 20 mΩ RISO 5 MΩ IR 16 A CERTIFICATION cULus Approval E150931 PACKAGING PROPERTIES Packaging Box <https://www.we-online.com/catalog/media/o165124v209%20Family_ConFAST_638207222004.jpg> Details see: https://www.we-online.com/catalog/en/FAST_5_08_THT_MALE_VERTICAL_6382072220XX/ Updated by Ella Wu 2020-08-11 2020(C) Wurth Elektronik; CONTACT-RESISTANCE: 20mOhm; DATASHEET-URL: https://www.we-online.com/catalog/datasheet/638207222007.pdf; GENDER: Male; IR: 16A; MOUNT: THT; PART-NUMBER: 638207222007; PINS: 7; PITCH: 5.08mm; TYPE: Vertical; WORKING-VOLTAGE: 300V(AC)
J15 = Wurth_Connectors_WR-FAST:638207222008: WR-FAST 5.08 mm THT Male Header Vertical Blade 2863 KIND PROPERTIES Pitch 5.08 mm Gender Male MATERIAL PROPERTIES Insulator Material PC Insulator Flammability Rating UL94 V-0 Insulator Color Black Contact Material Steel Contact Plating Tin Contact Type Stamped GENERAL INFORMATION Operating Temperature -30 up to +120 °C Working Voltage 300 V (AC) Withstanding Voltage 1600 V (AC) Contact Resistance 20 mΩ RISO 5 MΩ IR 16 A CERTIFICATION cULus Approval E150931 PACKAGING PROPERTIES Packaging Box <https://www.we-online.com/catalog/media/o165124v209%20Family_ConFAST_638207222004.jpg> Details see: https://www.we-online.com/catalog/en/FAST_5_08_THT_MALE_VERTICAL_6382072220XX/ Updated by Ella Wu 2020-08-11 2020(C) Wurth Elektronik; CONTACT-RESISTANCE: 20mOhm; DATASHEET-URL: https://www.we-online.com/catalog/datasheet/638207222008.pdf; GENDER: Male; IR: 16A; MOUNT: THT; PART-NUMBER: 638207222008; PINS: 8; PITCH: 5.08mm; TYPE: Vertical; WORKING-VOLTAGE: 300V(AC)
R1-R44 R51-R56 RX1-RX8 = resistor:R-EU_: RESISTOR, European symbol
RESET = Wurth_Switch_WS-TATU:431256083736: WS-TATV THT Tact Switch 6x6 mm Material Properties Cover Material : Carbon Steel Properties Actuator Material:LCP Actuator Flammability Rating:UL94 V-0 Actuator Color:Black; Salmon; White Frame Material:PPA Frame Flammability Rating:UL94 HB Frame Color:Black Contact Material:Stainless Steel Contact Plating:Silver Terminal Material:Copper Alloy Terminal Plating:Silver VR:12 V (DC) Contact Resistance Initial:100 mΩ Contact Resistance After Life Test:2 Ω RISO:100 MΩ Withstanding Voltage:250 V (AC) Qty.:500 Mechanical Properties Stroke 0.25 mm General Information Operating Temperature:-40 up to +85 °C Packaging Properties Packaging:Bulk <https://www.we-online.com/catalog/media/o61137v209%20Family_WS_TST_THT_4312560xx7x6_pf2.jpg> Details see: https://www.we-online.com/catalog/en/TATU_6X6_THT_RIGHT_ANGLED_WITH_GROUND_TERMINAL/ Updated by yingchun,Shan;2020-02-21 2020(C) Würth Elektronik; DATASHEET-URL: https://www.we-online.com/catalog/datasheet/431256083736.pdf; H: 8.35mm; OPERATION-FORCE: 360g; PART-NUMBER: 431256083736; QTY: 500
U2 U3 U5 U6 = BTS7030-2EPA:BTS7030-2EPA: BTS7030-2EPA PROFET +2, Smart High-Side Power Switch 30 mOhm Dual Channel SOP65P600X115-15N-V
U4 = TLE9250VSJ:TLE9250VSJ: TLE9250VSJ SOIC127P602X173-8N-V High Speed CAN FD Transceiver; ARTIKEL_NR: 545599

## Net classes
1 GND: width 0.127 mm, clearance 0.127 mm to class 0
2 Ampere7: width 3 mm, drill 0.3 mm, clearance 0.3 mm